# Altium project Lite Carrier for Mu.PrjPcb (part 1 of 2)
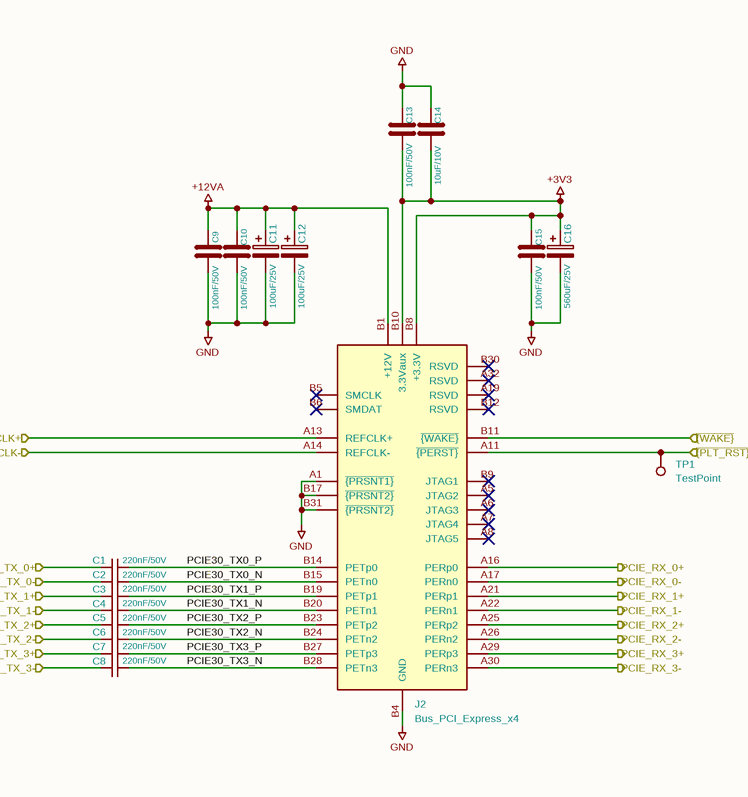
[diagram p0: PCIe x4.SchDoc]
11 sheets, 296 parts. Net scope: flat (ports and power ports of the same name join across sheets).
Board file: Lite Carrier for Mu.PcbDoc
Sheets:
  PCIe x4.SchDoc
  fan_temp.SchDoc
  LattePanda Module.SchDoc
  HDMI.SchDoc
  PSU.SchDoc
  M.2 E&M Key.SchDoc
  Gigabit Ethernet.SchDoc
  GPIO.SchDoc
  USB2.0&USB3.0.SchDoc
  fan&temp.SchDoc
  RTC.SchDoc

## Sheet PCIe x4.SchDoc
size 594 x 420 mm

### Parts
C1  220nF/50V  [C_0402_1005Metric]
C2  220nF/50V  [C_0402_1005Metric]
C3  220nF/50V  [C_0402_1005Metric]
C4  220nF/50V  [C_0402_1005Metric]
C5  220nF/50V  [C_0402_1005Metric]
C6  220nF/50V  [C_0402_1005Metric]
C7  220nF/50V  [C_0402_1005Metric]
C8  220nF/50V  [C_0402_1005Metric]
C9  100nF/50V  [C_0402_1005Metric]
C10  100nF/50V  [C_0402_1005Metric]
C11  100uF/25V  [CP_Elec_6.3x7.7]
C12  100uF/25V  [CP_Elec_6.3x7.7]
C13  100nF/50V  [C_0402_1005Metric]
C14  10uF/10V  [C_0402_1005Metric]
C15  100nF/50V  [C_0402_1005Metric]
C16  560uF/25V  [CP_Elec_6.3x7.7]
J2  Bus_PCI_Express_x4  [PCIe_x4_Gen3Slot_Connectors]
TP1  TestPoint  [TestPoint_Pad_D1.5mm]

### Ports
PCIE_RX_0+ (out), PCIE_RX_0- (out), PCIE_RX_1+ (out), PCIE_RX_1- (out), PCIE_RX_2+ (out), PCIE_RX_2- (out), PCIE_RX_3+ (out), PCIE_RX_3- (out), PCIE_TX_0+ (in), PCIE_TX_0- (in), PCIE_TX_1+ (in), PCIE_TX_1- (in), PCIE_TX_2+ (in), PCIE_TX_2- (in), PCIE_TX_3+ (in), PCIE_TX_3- (in), REFCLK+ (in), REFCLK- (in), ~{{PLT_RST}} (in), ~{{WAKE}} (in)

### Nets
+3V3: C13.2 C14.2 C15.1 C16.1 J2.B8(+3.3V) J2.B10(3.3Vaux)
+12VA: C9.1 C10.1 C11.1 C12.1 J2.B1(+12V)
GND: C9.2 C10.2 C11.2 C12.2 C13.1 C14.1 C15.2 C16.2 J2.A1(~{{PRSNT1}}) J2.B4(GND) J2.B17(~{{PRSNT2}}) J2.B31(~{{PRSNT2}})
PCIE30_TX0_N: C2.2 J2.B15(PETn0)
PCIE30_TX0_P: C1.2 J2.B14(PETp0)
PCIE30_TX1_N: C4.2 J2.B20(PETn1)
PCIE30_TX1_P: C3.2 J2.B19(PETp1)
PCIE30_TX2_N: C6.2 J2.B24(PETn2)
PCIE30_TX2_P: C5.2 J2.B23(PETp2)
PCIE30_TX3_N: C8.2 J2.B28(PETn3)
PCIE30_TX3_P: C7.2 J2.B27(PETp3)
PCIE_RX_0+: J2.A16(PERp0) ; port PCIE_RX_0+
PCIE_RX_0-: J2.A17(PERn0) ; port PCIE_RX_0-
PCIE_RX_1+: J2.A21(PERp1) ; port PCIE_RX_1+
PCIE_RX_1-: J2.A22(PERn1) ; port PCIE_RX_1-
PCIE_RX_2+: J2.A25(PERp2) ; port PCIE_RX_2+
PCIE_RX_2-: J2.A26(PERn2) ; port PCIE_RX_2-
PCIE_RX_3+: J2.A29(PERp3) ; port PCIE_RX_3+
PCIE_RX_3-: J2.A30(PERn3) ; port PCIE_RX_3-
PCIE_TX_0+: C1.1 ; port PCIE_TX_0+
PCIE_TX_0-: C2.1 ; port PCIE_TX_0-
PCIE_TX_1+: C3.1 ; port PCIE_TX_1+
PCIE_TX_1-: C4.1 ; port PCIE_TX_1-
PCIE_TX_2+: C5.1 ; port PCIE_TX_2+
PCIE_TX_2-: C6.1 ; port PCIE_TX_2-
PCIE_TX_3+: C7.1 ; port PCIE_TX_3+
PCIE_TX_3-: C8.1 ; port PCIE_TX_3-
REFCLK+: J2.A13(REFCLK+) ; port REFCLK+
REFCLK-: J2.A14(REFCLK-) ; port REFCLK-
~{{PLT_RST}}: J2.A11(~{{PERST}}) TP1.1 ; port ~{{PLT_RST}}
~{{WAKE}}: J2.B11(~{{WAKE}}) ; port ~{{WAKE}}

Not connected (* = marked no-connect by the designer): J2 A2(+12V) A3(+12V) A4(GND) A5(JTAG2)* A6(JTAG3)* A7(JTAG4)* A8(JTAG5)* A9(+3.3V) A10(+3.3V) A12(GND) A15(GND) A18(GND) A19(RSVD)* A20(GND) A23(GND) A24(GND) A27(GND) A28(GND) A31(GND) A32(RSVD)* B2(+12V) B3(+12V) B5(SMCLK)* B6(SMDAT)* B7(GND) B9(JTAG1)* B12(RSVD)* B13(GND) B16(GND) B18(GND) B21(GND) B22(GND) B25(GND) B26(GND) B29(GND) B30(RSVD)* B32(GND)

### Notes on the sheet
- 1
- 2
- 3
- 4
- 5
- 6
- 7
- 8
- 9
- 10
- 11
- A
- B
- C
- D
- E
- F
- G
- H
- Title: Primer Carrier for LattePanda Mu
- File: PCIe x4.kicad_sch
- Sheet: /
- DFRobot
- KiCad E.D.A.  kicad (5.1.4)-1
- Size: A2
- Date: 2024-03-13
- Rev: V1.0.0
- Id: 1/1

### Library data of the parts
C1-C8 = C_Small: SCH_Show_Footprint: C0402; Value: 220nF/50V; Footprint: A_HDJ_Library:C_0402_1005Metric
C9 C10 C13-C15 = C: SCH_Show_Footprint: C0402; Footprint: A_HDJ_Library:C_0402_1005Metric
  C9 C10 C13 C15: Value: 100nF/50V
  C14: Value: 10uF/10V
C11 C12 C16 = C_Polarized: SCH_Show_Footprint: C5x5.8; Footprint: A_HDJ_Library:CP_Elec_6.3x7.7
  C11 C12: Value: 100uF/25V
  C16: Value: 560uF/25V
J2 = Bus_PCI_Express_x4: Value: Bus_PCI_Express_x4; Footprint: A_HDJ_Library:PCIe_x4_Gen3Slot_Connectors
TP1 = TestPoint: Value: TestPoint; Footprint: A_HDJ_Library:TestPoint_Pad_D1.5mm

## Sheet fan_temp.SchDoc
size 594 x 420 mm
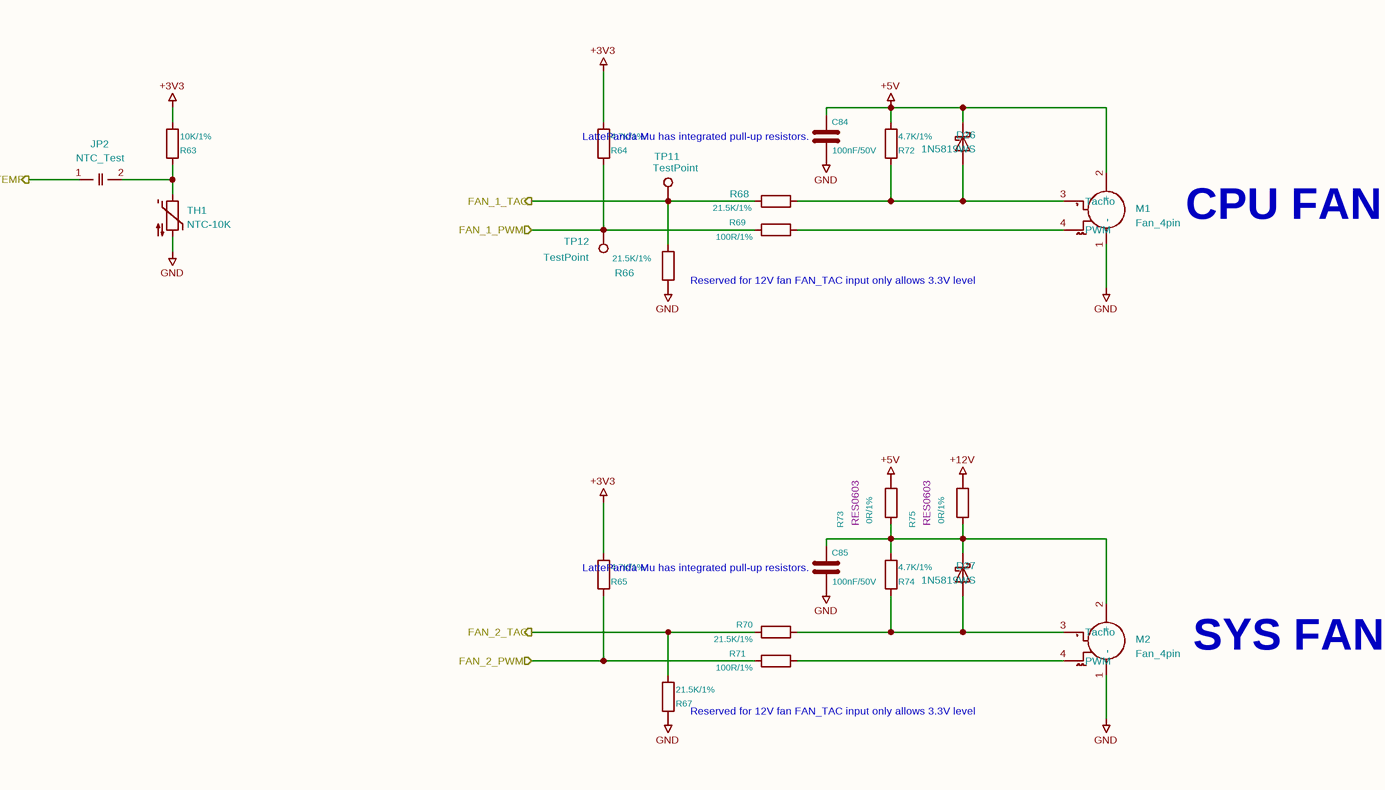
[diagram p1: fan_temp.SchDoc]

### Parts
(Parts that share a designator on the sheet are numbered #1, #2 ... from top to bottom, then left to right.)
C84  100nF/50V  [C_0402_1005Metric]
C85  100nF/50V  [C_0402_1005Metric]
D26  1N5819WS  [D_SOD-323]
D27  1N5819WS  [D_SOD-323]
JP2#1  NTC_Test  [SolderJumper-2_P1.3mm_Open_RoundedPad1.0x1.5mm]
M1#1  Fan_4pin  [JST_PH_B4B-PH-K_1x04_P2.00mm_Vertical]
M2#1  Fan_4pin  [JST_PH_B4B-PH-K_1x04_P2.00mm_Vertical]
R63  10K/1%  [R_0402_1005Metric]
R64  4.7K/1%  [R_0402_1005Metric]
R65  4.7K/1%  [R_0402_1005Metric]
R66  21.5K/1%  [R_0402_1005Metric]
R67  21.5K/1%  [R_0402_1005Metric]
R68  21.5K/1%  [R_0402_1005Metric]
R69  100R/1%  [R_0402_1005Metric]
R70  21.5K/1%  [R_0402_1005Metric]
R71  100R/1%  [R_0402_1005Metric]
R72  4.7K/1%  [R_0402_1005Metric]
R73  0R/1%  [RES0603]
R74  4.7K/1%  [R_0402_1005Metric]
R75  0R/1%  [RES0603]
TH1#1  NTC-10K  [R_0603_1608Metric]
TP11  TestPoint  [TestPoint_Pad_D1.5mm]
TP12  TestPoint  [TestPoint_Pad_D1.5mm]

### Ports
FAN_1_PWM (in), FAN_1_TAC (out), FAN_2_PWM (in), FAN_2_TAC (out), TEMP (out)

### Nets
+3V3: R63.1 R64.1 R65.1
+5V: C84.1 D26.1(K) M1#1.2(+) R72.1 R73.2
+12V: R75.2
GND: C84.2 C85.2 M1#1.1(-) M2#1.1(-) R66.2 R67.2 TH1#1.2
FAN_1_PWM: R64.2 R69.1 TP12.1 ; port FAN_1_PWM
FAN_1_TAC: R66.1 R68.2 TP11.1 ; port FAN_1_TAC
FAN_2_PWM: R65.2 R71.1 ; port FAN_2_PWM
FAN_2_TAC: R67.1 R70.1 ; port FAN_2_TAC
TEMP: JP2#1.1(A) ; port TEMP
NetC85_1: C85.1 D27.1(K) M2#1.2(+) R73.1 R74.1 R75.1
NetD26_2: D26.2(A) M1#1.3(Tacho) R68.1 R72.2
NetD27_2: D27.2(A) M2#1.3(Tacho) R70.2 R74.2
NetJP2#1_2: JP2#1.2(B) R63.2 TH1#1.1
NetM1#1_4: M1#1.4(PWM) R69.2
NetM2#1_4: M2#1.4(PWM) R71.2

### Notes on the sheet
- LattePanda Mu has integrated pull-up resistors.
- CPU FAN
- (near R66) Reserved for 12V fan
  FAN_TAC input only allows 3.3V level
- SYS FAN
- (near R67) Reserved for 12V fan
  FAN_TAC input only allows 3.3V level
- 1
- 2
- 3
- 4
- 5
- 6
- 7
- 8
- 9
- 10
- 11
- A
- B
- C
- D
- E
- F
- G
- H
- Title: Primer Carrier for LattePanda Mu
- File: fan_temp.kicad_sch
- Sheet: /
- DFRobot
- KiCad E.D.A.  kicad (5.1.4)-1
- Size: A2
- Date: 2024-03-13
- Rev: V1.0.0
- Id: 1/1

### Library data of the parts
C84 C85 = C: SCH_Show_Footprint: C0402; Value: 100nF/50V
  C84: Footprint: A_HDJ_Library:C_0402_1005Metric
  C85: Footprint: Capacitor_SMD:C_0402_1005Metric
D26 D27 = 1N5819WS: SCH_Show_Footprint: SOD-323; Value: 1N5819WS
  D26: Footprint: A_HDJ_Library:D_SOD-323
  D27: Footprint: Diode_SMD:D_SOD-323
JP2#1 = SolderJumper_2_Open: Value: NTC_Test; Footprint: Jumper:SolderJumper-2_P1.3mm_Open_RoundedPad1.0x1.5mm
R63-R75 = R
  R63: Value: 10K/1%; Footprint: Resistor_SMD:R_0402_1005Metric
  R64 R65 R74: Value: 4.7K/1%; Footprint: Resistor_SMD:R_0402_1005Metric
  R66 R67 R70: Value: 21.5K/1%; Footprint: Resistor_SMD:R_0402_1005Metric
  R68: Value: 21.5K/1%; Footprint: A_HDJ_Library:R_0402_1005Metric
  R69: Value: 100R/1%; Footprint: A_HDJ_Library:R_0402_1005Metric
  R71: Value: 100R/1%; Footprint: Resistor_SMD:R_0402_1005Metric
  R72: Value: 4.7K/1%; Footprint: A_HDJ_Library:R_0402_1005Metric
  R73 R75: Value: 0R/1%
TH1#1 = Thermistor_NTC: Value: NTC-10K; Footprint: Resistor_SMD:R_0603_1608Metric
M1#1 M2#1 = Fan_4pin: Value: Fan_4pin
  M1#1: Footprint: A_HDJ_Library:JST_PH_B4B-PH-K_1x04_P2.00mm_Vertical
  M2#1: Footprint: Connector_JST:JST_PH_B4B-PH-K_1x04_P2.00mm_Vertical
TP11 TP12 = TestPoint: Value: TestPoint; Footprint: A_HDJ_Library:TestPoint_Pad_D1.5mm

## Sheet LattePanda Module.SchDoc
size 594 x 420 mm
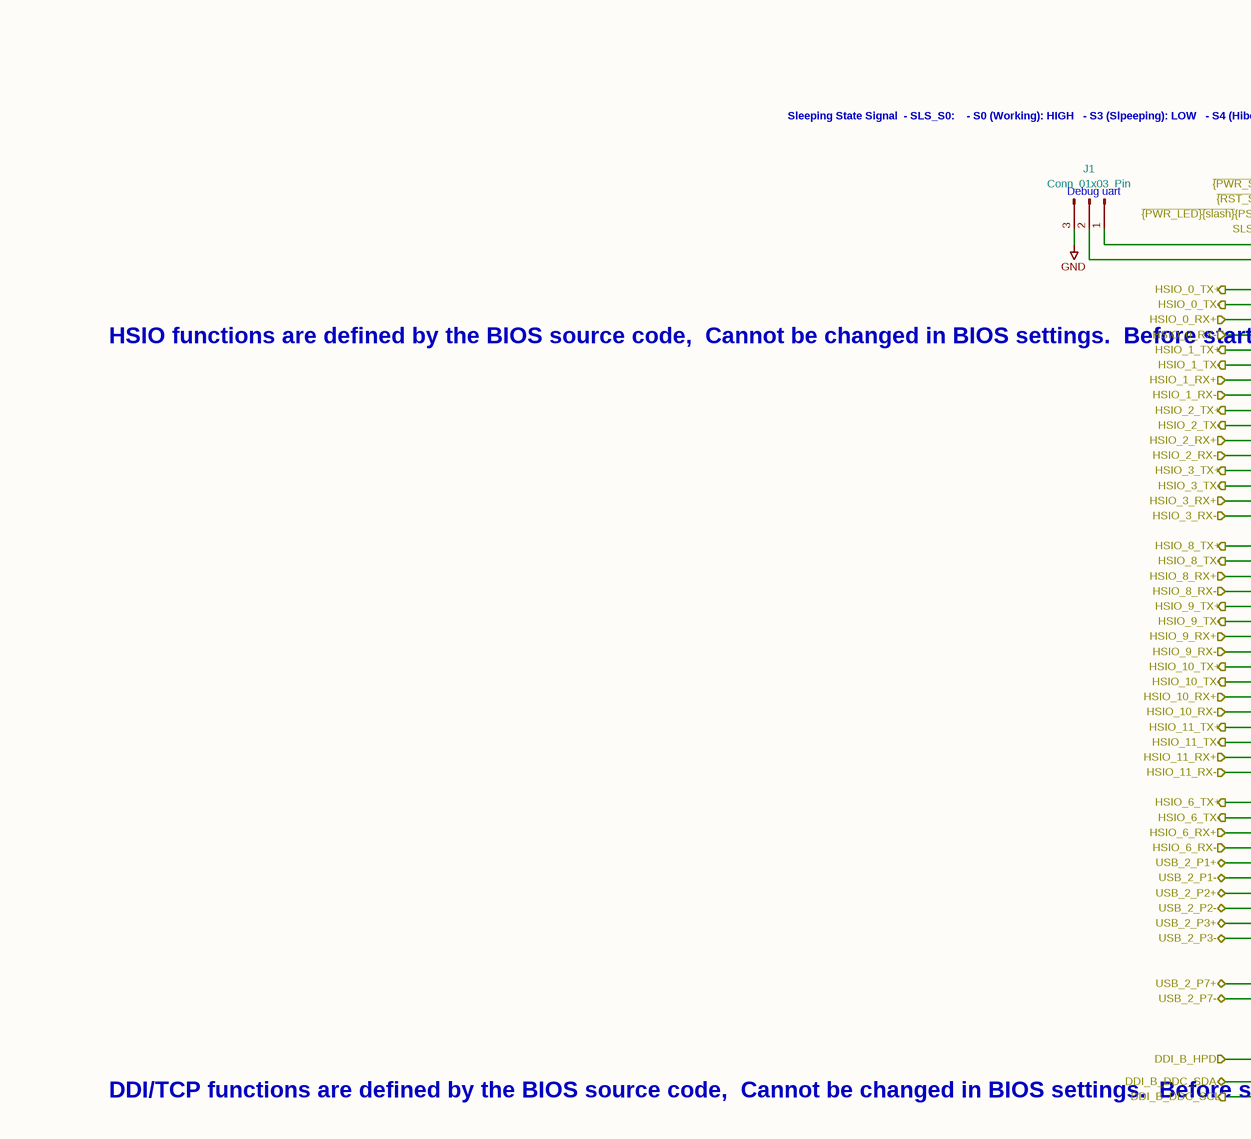
[diagram p2: LattePanda Module.SchDoc, top left]
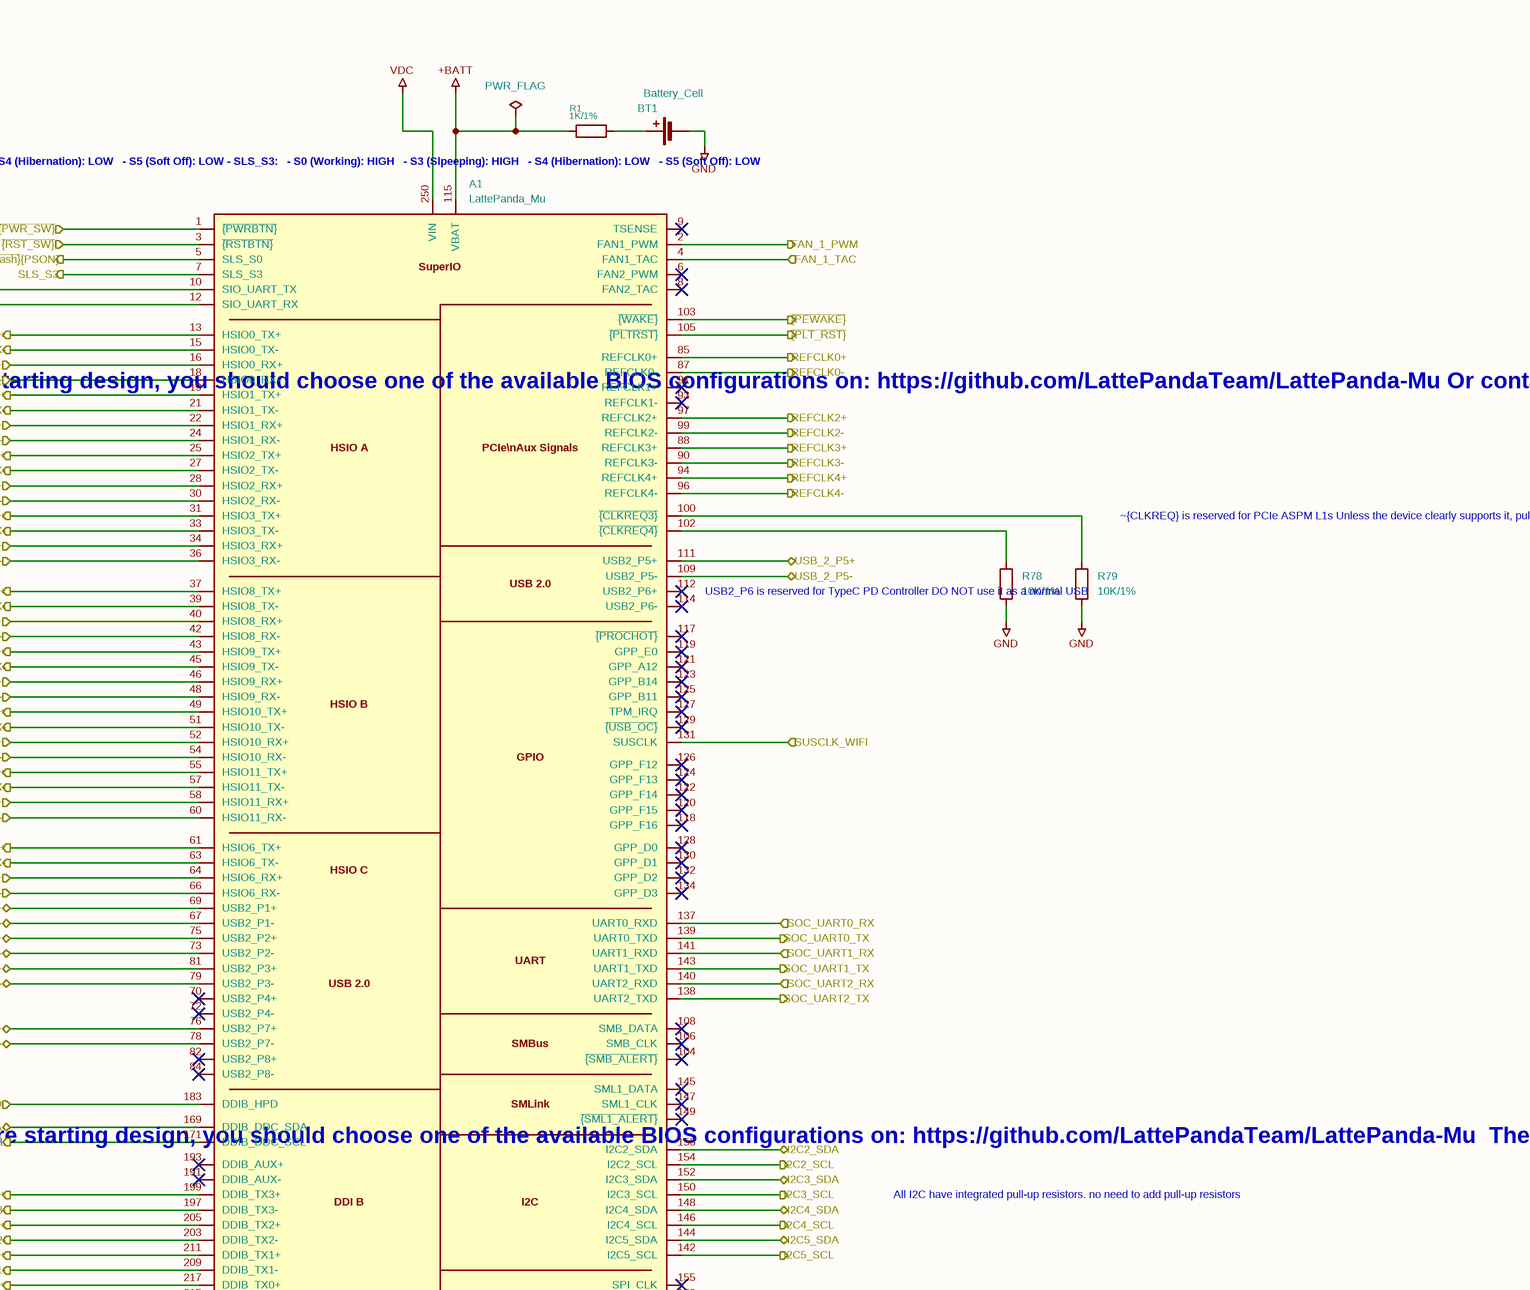
[diagram p3: LattePanda Module.SchDoc, top right]
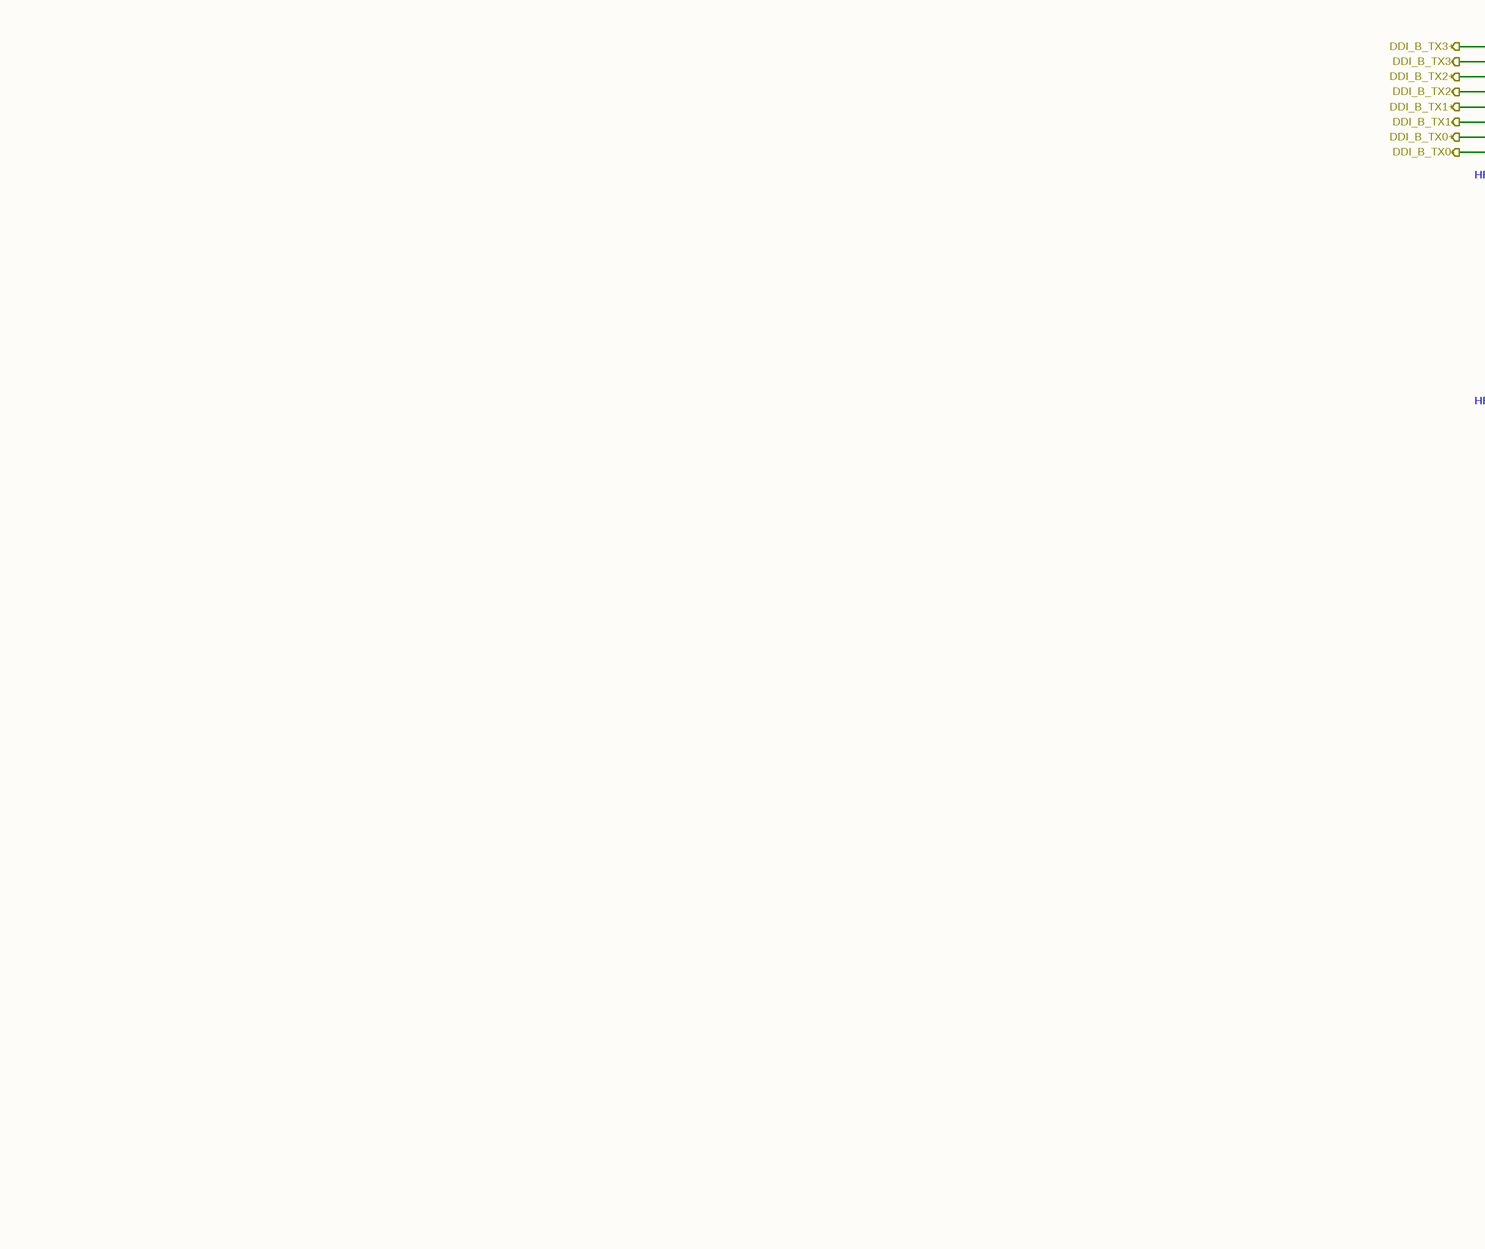
[diagram p4: LattePanda Module.SchDoc, bottom left]
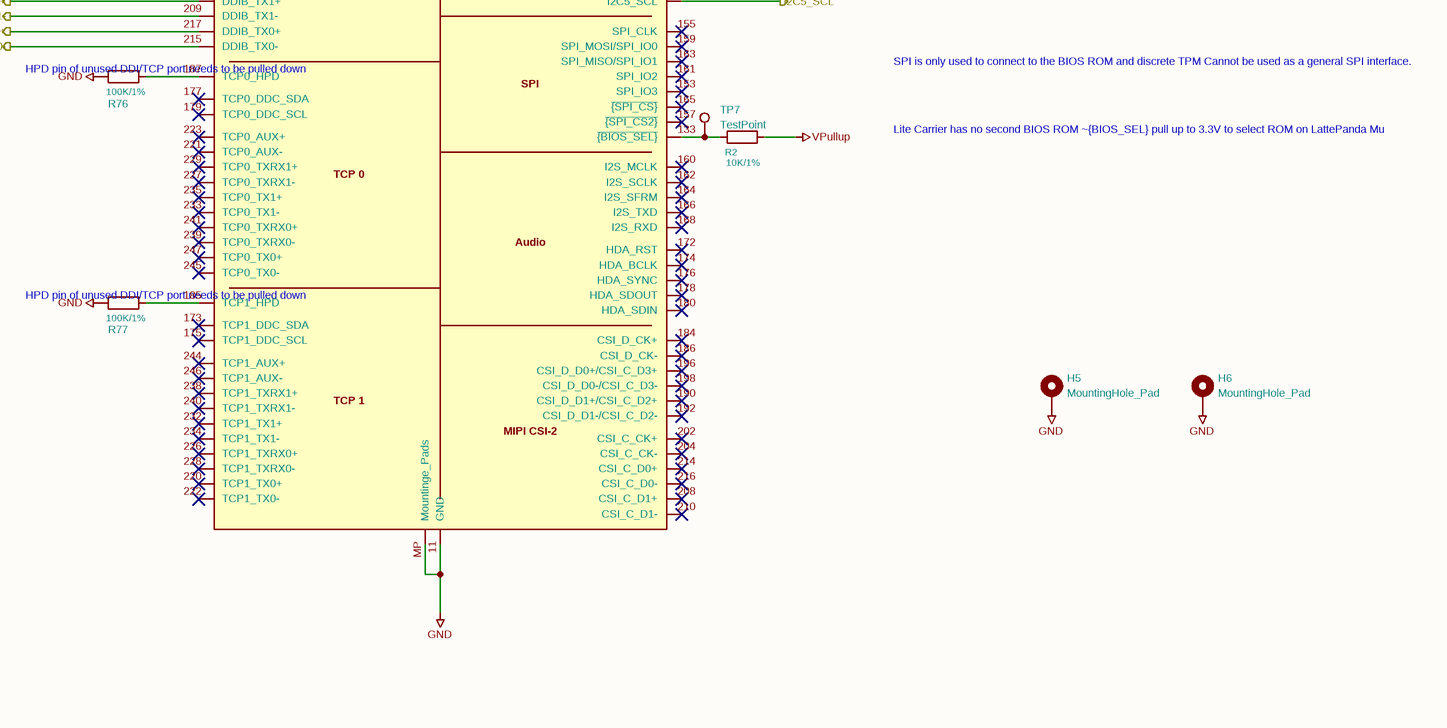
[diagram p5: LattePanda Module.SchDoc, bottom right]

### Parts
(Parts that share a designator on the sheet are numbered #1, #2 ... from top to bottom, then left to right.)
#FLG0201  PWR_FLAG  (graphical)
A1  LattePanda_Mu  [LattePanda_Module_H8.0mm_Horizontal]
BT1  Battery_Cell  [Battery_Holder_CR1220_S8411-45R]
H5  MountingHole_Pad  [MountingHole_3mm_M2_Pad_TopOnly]
H6  MountingHole_Pad  [MountingHole_3mm_M2_Pad_TopOnly]
J1  Conn_01x03_Pin  [PinHeader_1x03_P2.54mm_Vertical]
R1#1  1K/1%  [R_0402_1005Metric]
R2  10K/1%  [R_0402_1005Metric]
R76  100K/1%  [R_0402_1005Metric]
R77  100K/1%  [R_0402_1005Metric]
R78  10K/1%  [R_0402_1005Metric]
R79  10K/1%  [R_0402_1005Metric]
TP7  TestPoint  [TestPoint_Pad_D1.5mm]

### Ports
DDI_B_DDC_SCL (out), DDI_B_DDC_SDA (bidir), DDI_B_HPD (in), DDI_B_TX0+ (out), DDI_B_TX0- (out), DDI_B_TX1+ (out), DDI_B_TX1- (out), DDI_B_TX2+ (out), DDI_B_TX2- (out), DDI_B_TX3+ (out), DDI_B_TX3- (out), FAN_1_PWM (out), FAN_1_TAC (in), HSIO_0_RX+ (in), HSIO_0_RX- (in), HSIO_0_TX+ (out), HSIO_0_TX- (out), HSIO_1_RX+ (in), HSIO_1_RX- (in), HSIO_1_TX+ (out), HSIO_1_TX- (out), HSIO_2_RX+ (in), HSIO_2_RX- (in), HSIO_2_TX+ (out), HSIO_2_TX- (out), HSIO_3_RX+ (in), HSIO_3_RX- (in), HSIO_3_TX+ (out), HSIO_3_TX- (out), HSIO_6_RX+ (in), HSIO_6_RX- (in), HSIO_6_TX+ (out), HSIO_6_TX- (out), HSIO_8_RX+ (in), HSIO_8_RX- (in), HSIO_8_TX+ (out), HSIO_8_TX- (out), HSIO_9_RX+ (in), HSIO_9_RX- (in), HSIO_9_TX+ (out), HSIO_9_TX- (out), HSIO_10_RX+ (in), HSIO_10_RX- (in), HSIO_10_TX+ (out), HSIO_10_TX- (out), HSIO_11_RX+ (in), HSIO_11_RX- (in), HSIO_11_TX+ (out), HSIO_11_TX- (out), I2C2_SCL (out), I2C2_SDA (bidir), I2C3_SCL (out), I2C3_SDA (bidir), I2C4_SCL (out), I2C4_SDA (bidir), I2C5_SCL (out), I2C5_SDA (bidir), REFCLK0+ (out), REFCLK0- (out), REFCLK2+ (out), REFCLK2- (out), REFCLK3+ (out), REFCLK3- (out), REFCLK4+ (out), REFCLK4- (out), SLS_S3 (out), SOC_UART0_RX (in), SOC_UART0_TX (out), SOC_UART1_RX (in), SOC_UART1_TX (out), SOC_UART2_RX (in), SOC_UART2_TX (out), SUSCLK_WIFI (in), USB_2_P1+ (bidir), USB_2_P1- (bidir), USB_2_P2+ (bidir), USB_2_P2- (bidir), USB_2_P3+ (bidir), USB_2_P3- (bidir), USB_2_P5+ (bidir), USB_2_P5- (bidir), USB_2_P7+ (bidir), USB_2_P7- (bidir), ~{{PEWAKE}} (out), ~{{PLT_RST}} (out), ~{{PWR_LED}{slash}}{PSON} (out), ~{{PWR_SW}} (in), ~{{RST_SW}} (in)

### Nets
+BATT: #FLG0201.1 A1.115(VBAT) R1#1.1
GND: A1.11(GND) A1.MP(Mountinge_Pads) BT1.2(-) H5.1 H6.1 J1.3(Pin_3) R76.2 R77.2 R78.2 R79.2
VDC: A1.250(VIN)
VPullup: R2.2
CON_USB1_D_N: A1.109(USB2_P5-) ; port USB_2_P5-
CON_USB1_D_P: A1.111(USB2_P5+) ; port USB_2_P5+
CON_USB2_D_N: A1.79(USB2_P3-) ; port USB_2_P3-
CON_USB2_D_P: A1.81(USB2_P3+) ; port USB_2_P3+
CON_USB3_D_N: A1.73(USB2_P2-) ; port USB_2_P2-
CON_USB3_D_P: A1.75(USB2_P2+) ; port USB_2_P2+
CON_USB4_D_N: A1.67(USB2_P1-) ; port USB_2_P1-
CON_USB4_D_P: A1.69(USB2_P1+) ; port USB_2_P1+
DDI_B_DDC_SCL: A1.171(DDIB_DDC_SCL) ; port DDI_B_DDC_SCL
DDI_B_DDC_SDA: A1.169(DDIB_DDC_SDA) ; port DDI_B_DDC_SDA
DDI_B_HPD: A1.183(DDIB_HPD) ; port DDI_B_HPD
DDI_B_TX0+: A1.217(DDIB_TX0+) ; port DDI_B_TX0+
DDI_B_TX0-: A1.215(DDIB_TX0-) ; port DDI_B_TX0-
DDI_B_TX1+: A1.211(DDIB_TX1+) ; port DDI_B_TX1+
DDI_B_TX1-: A1.209(DDIB_TX1-) ; port DDI_B_TX1-
DDI_B_TX2+: A1.205(DDIB_TX2+) ; port DDI_B_TX2+
DDI_B_TX2-: A1.203(DDIB_TX2-) ; port DDI_B_TX2-
DDI_B_TX3+: A1.199(DDIB_TX3+) ; port DDI_B_TX3+
DDI_B_TX3-: A1.197(DDIB_TX3-) ; port DDI_B_TX3-
FAN_1_PWM: A1.2(FAN1_PWM) ; port FAN_1_PWM
FAN_1_TAC: A1.4(FAN1_TAC) ; port FAN_1_TAC
HSIO_0_RX+: A1.16(HSIO0_RX+) ; port HSIO_0_RX+
HSIO_0_RX-: A1.18(HSIO0_RX-) ; port HSIO_0_RX-
HSIO_0_TX+: A1.13(HSIO0_TX+) ; port HSIO_0_TX+
HSIO_0_TX-: A1.15(HSIO0_TX-) ; port HSIO_0_TX-
HSIO_1_RX+: A1.22(HSIO1_RX+) ; port HSIO_1_RX+
HSIO_1_RX-: A1.24(HSIO1_RX-) ; port HSIO_1_RX-
HSIO_1_TX+: A1.19(HSIO1_TX+) ; port HSIO_1_TX+
HSIO_1_TX-: A1.21(HSIO1_TX-) ; port HSIO_1_TX-
HSIO_2_RX+: A1.28(HSIO2_RX+) ; port HSIO_2_RX+
HSIO_2_RX-: A1.30(HSIO2_RX-) ; port HSIO_2_RX-
HSIO_2_TX+: A1.25(HSIO2_TX+) ; port HSIO_2_TX+
HSIO_2_TX-: A1.27(HSIO2_TX-) ; port HSIO_2_TX-
HSIO_3_RX+: A1.34(HSIO3_RX+) ; port HSIO_3_RX+
HSIO_3_RX-: A1.36(HSIO3_RX-) ; port HSIO_3_RX-
HSIO_3_TX+: A1.31(HSIO3_TX+) ; port HSIO_3_TX+
HSIO_3_TX-: A1.33(HSIO3_TX-) ; port HSIO_3_TX-
HSIO_6_RX+: A1.64(HSIO6_RX+) ; port HSIO_6_RX+
HSIO_6_RX-: A1.66(HSIO6_RX-) ; port HSIO_6_RX-
HSIO_6_TX+: A1.61(HSIO6_TX+) ; port HSIO_6_TX+
HSIO_6_TX-: A1.63(HSIO6_TX-) ; port HSIO_6_TX-
HSIO_8_RX+: A1.40(HSIO8_RX+) ; port HSIO_8_RX+
HSIO_8_RX-: A1.42(HSIO8_RX-) ; port HSIO_8_RX-
HSIO_8_TX+: A1.37(HSIO8_TX+) ; port HSIO_8_TX+
HSIO_8_TX-: A1.39(HSIO8_TX-) ; port HSIO_8_TX-
HSIO_9_RX+: A1.46(HSIO9_RX+) ; port HSIO_9_RX+
HSIO_9_RX-: A1.48(HSIO9_RX-) ; port HSIO_9_RX-
HSIO_9_TX+: A1.43(HSIO9_TX+) ; port HSIO_9_TX+
HSIO_9_TX-: A1.45(HSIO9_TX-) ; port HSIO_9_TX-
HSIO_10_RX+: A1.52(HSIO10_RX+) ; port HSIO_10_RX+
HSIO_10_RX-: A1.54(HSIO10_RX-) ; port HSIO_10_RX-
HSIO_10_TX+: A1.49(HSIO10_TX+) ; port HSIO_10_TX+
HSIO_10_TX-: A1.51(HSIO10_TX-) ; port HSIO_10_TX-
HSIO_11_RX+: A1.58(HSIO11_RX+) ; port HSIO_11_RX+
HSIO_11_RX-: A1.60(HSIO11_RX-) ; port HSIO_11_RX-
HSIO_11_TX+: A1.55(HSIO11_TX+) ; port HSIO_11_TX+
HSIO_11_TX-: A1.57(HSIO11_TX-) ; port HSIO_11_TX-
I2C2_SCL: A1.154(I2C2_SCL) ; port I2C2_SCL
I2C2_SDA: A1.156(I2C2_SDA) ; port I2C2_SDA
I2C3_SCL: A1.150(I2C3_SCL) ; port I2C3_SCL
I2C3_SDA: A1.152(I2C3_SDA) ; port I2C3_SDA
I2C4_SCL: A1.146(I2C4_SCL) ; port I2C4_SCL
I2C4_SDA: A1.148(I2C4_SDA) ; port I2C4_SDA
I2C5_SCL: A1.142(I2C5_SCL) ; port I2C5_SCL
I2C5_SDA: A1.144(I2C5_SDA) ; port I2C5_SDA
REFCLK0+: A1.85(REFCLK0+) ; port REFCLK0+
REFCLK0-: A1.87(REFCLK0-) ; port REFCLK0-
REFCLK2+: A1.97(REFCLK2+) ; port REFCLK2+
REFCLK2-: A1.99(REFCLK2-) ; port REFCLK2-
REFCLK3+: A1.88(REFCLK3+) ; port REFCLK3+
REFCLK3-: A1.90(REFCLK3-) ; port REFCLK3-
REFCLK4+: A1.94(REFCLK4+) ; port REFCLK4+
REFCLK4-: A1.96(REFCLK4-) ; port REFCLK4-
SLS_S3: A1.7(SLS_S3) ; port SLS_S3
SOC_UART0_RX: A1.137(UART0_RXD) ; port SOC_UART0_RX
SOC_UART0_TX: A1.139(UART0_TXD) ; port SOC_UART0_TX
SOC_UART1_RX: A1.141(UART1_RXD) ; port SOC_UART1_RX
SOC_UART1_TX: A1.143(UART1_TXD) ; port SOC_UART1_TX
SOC_UART2_RX: A1.140(UART2_RXD) ; port SOC_UART2_RX
SOC_UART2_TX: A1.138(UART2_TXD) ; port SOC_UART2_TX
SUSCLK_WIFI: A1.131(SUSCLK) ; port SUSCLK_WIFI
USB_2_P7+: A1.76(USB2_P7+) ; port USB_2_P7+
USB_2_P7-: A1.78(USB2_P7-) ; port USB_2_P7-
~{{PEWAKE}}: A1.103(~{{WAKE}}) ; port ~{{PEWAKE}}
~{{PLT_RST}}: A1.105(~{{PLTRST}}) ; port ~{{PLT_RST}}
~{{PWR_LED}{slash}}{PSON}: A1.5(SLS_S0) ; port ~{{PWR_LED}{slash}}{PSON}
~{{PWR_SW}}: A1.1(~{{PWRBTN}}) ; port ~{{PWR_SW}}
~{{RST_SW}}: A1.3(~{{RSTBTN}}) ; port ~{{RST_SW}}
NetA1_10: A1.10(SIO_UART_TX) J1.1(Pin_1)
NetA1_12: A1.12(SIO_UART_RX) J1.2(Pin_2)
NetA1_100: A1.100(~{{CLKREQ3}}) R79.1
NetA1_102: A1.102(~{{CLKREQ4}}) R78.1
NetA1_133: A1.133(~{{BIOS_SEL}}) R2.1 TP7.1
NetA1_185: A1.185(TCP1_HPD) R77.1
NetA1_187: A1.187(TCP0_HPD) R76.1
NetBT1_1: BT1.1(+) R1#1.2

Not connected (* = marked no-connect by the designer): A1 6(FAN2_PWM)* 8(FAN2_TAC)* 9(TSENSE)* 14(GND) 17(GND) 20(GND) 23(GND) 26(GND) 29(GND) 32(GND) 35(GND) 38(GND) 41(GND) 44(GND) 47(GND) 50(GND) 53(GND) 56(GND) 59(GND) 62(GND) 65(GND) 68(GND) 70(USB2_P4+)* 71(GND) 72(USB2_P4-)* 74(GND) 77(GND) 80(GND) 82(USB2_P8+)* 83(GND) 84(USB2_P8-)* 86(GND) 89(GND) 91(REFCLK1+)* 92(GND) 93(REFCLK1-)* 95(GND) 98(GND) 101(GND) 104(~{{SMB_ALERT}})* 106(SMB_CLK)* 107(GND) 108(SMB_DATA)* 110(GND) 112(USB2_P6+)* 113(GND) 114(USB2_P6-)* 116(GND) 117(~{{PROCHOT}})* 118(GPP_F16)* 119(GPP_E0)* 120(GPP_F15)* 121(GPP_A12)* 122(GPP_F14)* 123(GPP_B14)* 124(GPP_F13)* 125(GPP_B11)* 126(GPP_F12)* 127(TPM_IRQ)* 128(GPP_D0)* 129(~{{USB_OC}})* 130(GPP_D1)* 132(GPP_D2)* 134(GPP_D3)* 135(GND) 136(GND) 145(SML1_DATA)* 147(SML1_CLK)* 149(~{{SML1_ALERT}})* 151(GND) 153(SPI_IO3)* 155(SPI_CLK)* 157(~{{SPI_CS2}})* 158(GND) 159(SPI_MOSI/SPI_IO0)* 160(I2S_MCLK)* 161(SPI_IO2)* 162(I2S_SCLK)* 163(SPI_MISO/SPI_IO1)* 164(I2S_SFRM)* 165(~{{SPI_CS}})* 166(I2S_TXD)* 167(GND) 168(I2S_RXD)* 170(GND) 172(HDA_RST)* 173(TCP1_DDC_SDA)* 174(HDA_BCLK)* 175(TCP1_DDC_SCL)* 176(HDA_SYNC)* 177(TCP0_DDC_SDA)* 178(HDA_SDOUT)* 179(TCP0_DDC_SCL)* 180(HDA_SDIN)* 181(GND) 182(GND) 184(CSI_D_CK+)* 186(CSI_D_CK-)* 188(GND) 189(GND) 190(CSI_D_D1+/CSI_C_D2+)* 191(DDIB_AUX-)* 192(CSI_D_D1-/CSI_C_D2-)* 193(DDIB_AUX+)* 194(GND) 195(GND) 196(CSI_D_D0+/CSI_C_D3+)* 198(CSI_D_D0-/CSI_C_D3-)* 200(GND) 201(GND) 202(CSI_C_CK+)* 204(CSI_C_CK-)* 206(GND) 207(GND) 208(CSI_C_D1+)* 210(CSI_C_D1-)* 212(GND) 213(GND) 214(CSI_C_D0+)* 216(CSI_C_D0-)* 218(GND) 219(GND) 220(TCP1_TX0+)* 221(TCP0_AUX-)* 222(TCP1_TX0-)* 223(TCP0_AUX+)* 224(GND) 225(GND) 226(TCP1_TXRX0+)* 227(TCP0_TXRX1-)* 228(TCP1_TXRX0-)* 229(TCP0_TXRX1+)* 230(GND) 231(GND) 232(TCP1_TX1+)* 233(TCP0_TX1-)* 234(TCP1_TX1-)* 235(TCP0_TX1+)* 236(GND) 237(GND) 238(TCP1_TXRX1+)* 239(TCP0_TXRX0-)* 240(TCP1_TXRX1-)* 241(TCP0_TXRX0+)* 242(GND) 243(GND) 244(TCP1_AUX+)* 245(TCP0_TX0-)* 246(TCP1_AUX-)* 247(TCP0_TX0+)* 248(GND) 249(GND) 251(VIN) 252(VIN) 253(VIN) 254(VIN) 255(VIN) 256(VIN) 257(VIN) 258(VIN) 259(VIN) 260(VIN)

### Notes on the sheet
- Sleeping State Signal
  - SLS_S0:
  - S0 (Working): HIGH
  - S3 (Slpeeping): LOW
  - S4 (Hibernation): LOW
  - S5 (Soft Off): LOW
  - SLS_S3:
  - S0 (Working): HIGH
  - S3 (Slpeeping): HIGH
  - S4 (Hibernation): LOW
  - S5 (Soft Off): LOW
- (near J1) Debug uart
- (near A1) HSIO functions are defined by the BIOS source code,
  Cannot be changed in BIOS settings.
  Before starting design, you should choose one of
  the available BIOS configurations on:
  https://github.com/LattePandaTeam/LattePanda-Mu
  Or contact techsupport for custom your BIOS
  The default functions are defined as follows:
  - HSIO0: USB3.2 10Gbps
  - HSIO1: USB3.2 10Gbps
  - HSIO2: PCIe 3.0 x1
  - HSIO3: PCIe 3.0 x1
  - HSIO8: PCIe 3.0 x4 (Lane 0)
  - HSIO9: PCIe 3.0 x4 (Lane 1)
  - HSIO10: PCIe 3.0 x4 (Lane 2)
  - HSIO11: PCIe 3.0 x4 (Lane 3)
  - HSIO6: PCIe 3.0 x1
- (near R79) ~{CLKREQ} is reserved for PCIe ASPM L1s
  Unless the device clearly supports it, pull it down to enhance compatibility
- USB2_P6 is reserved for TypeC PD Controller
  DO NOT use it as a normal USB
- (near A1) DDI/TCP functions are defined by the BIOS source code,
  Cannot be changed in BIOS settings.
  Before starting design, you should choose one of
  the available BIOS configurations on:
  https://github.com/LattePandaTeam/LattePanda-Mu
  The default functions are defined as follows:
  - DDIA: eDP 1.4b (the 40Pin connector on the Mu)
  - DDIB: HDMI 2.0
  - TCP0: HDMI 2.0
  - TCP1: USB TypeC (need external PD controller)
- All I2C have integrated pull-up resistors.
  no need to add pull-up resistors
- HPD pin of unused DDI/TCP port
  needs to be pulled down
- SPI is only used to connect to the BIOS ROM and discrete TPM
  Cannot be used as a general SPI interface.
- Lite Carrier has no second BIOS ROM
  ~{BIOS_SEL} pull up to 3.3V to select ROM on LattePanda Mu
- 1
- 2
- 3
- 4
- 5
- 6
- 7
- 8
- 9
- 10
- 11
- A
- B
- C
- D
- E
- F
- G
- H
- 20240406
- Title: Primer Carrier for LattePanda Mu
- File: LattePanda Module.kicad_sch
- Sheet: /
- DFRobot
- KiCad E.D.A.  kicad (5.1.4)-1
- Size: A2
- Date: 2024-04-06
- Rev: V1.0.0
- Id: 1/1
- (in symbol LattePanda_Mu) SuperIO; HSIO A; PCIe\nAux Signals; USB 2.0; HSIO B; GPIO; HSIO C; UART; SMBus; SMLink; DDI B; I2C; SPI; TCP 0; Audio; TCP 1; MIPI CSI-2

### Library data of the parts
R1#1 R2 R76-R79 = R
  R1#1: Value: 1K/1%; Footprint: A_HDJ_Library:R_0402_1005Metric
  R2: Value: 10K/1%; Footprint: A_HDJ_Library:R_0402_1005Metric
  R76 R77: Value: 100K/1%; Footprint: A_HDJ_Library:R_0402_1005Metric
  R78 R79: Value: 10K/1%; Footprint: Resistor_SMD:R_0402_1005Metric
#FLG0201 = PWR_FLAG: Value: PWR_FLAG
A1 = LattePanda_Mu: Value: LattePanda_Mu; Footprint: Module_LattePanda:LattePanda_Module_H8.0mm_Horizontal
BT1 = Battery_Cell: Value: Battery_Cell; Footprint: A_HDJ_Library:Battery_Holder_CR1220_S8411-45R
H5 H6 = MountingHole_Pad: Value: MountingHole_Pad; Footprint: A_HDJ_Library:MountingHole_3mm_M2_Pad_TopOnly
J1 = Conn_01x03_Pin: Value: Conn_01x03_Pin; Footprint: A_HDJ_Library:PinHeader_1x03_P2.54mm_Vertical
TP7 = TestPoint: Value: TestPoint; Footprint: A_HDJ_Library:TestPoint_Pad_D1.5mm

## Sheet HDMI.SchDoc
size 594 x 420 mm
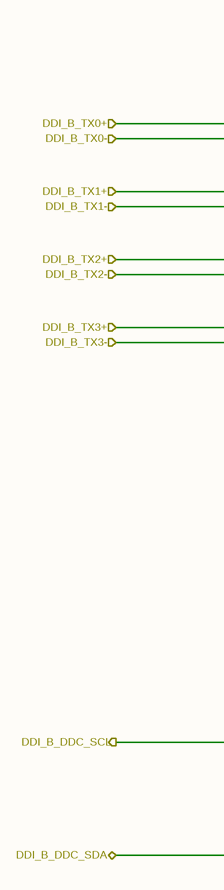
[diagram p6: HDMI.SchDoc, top left]
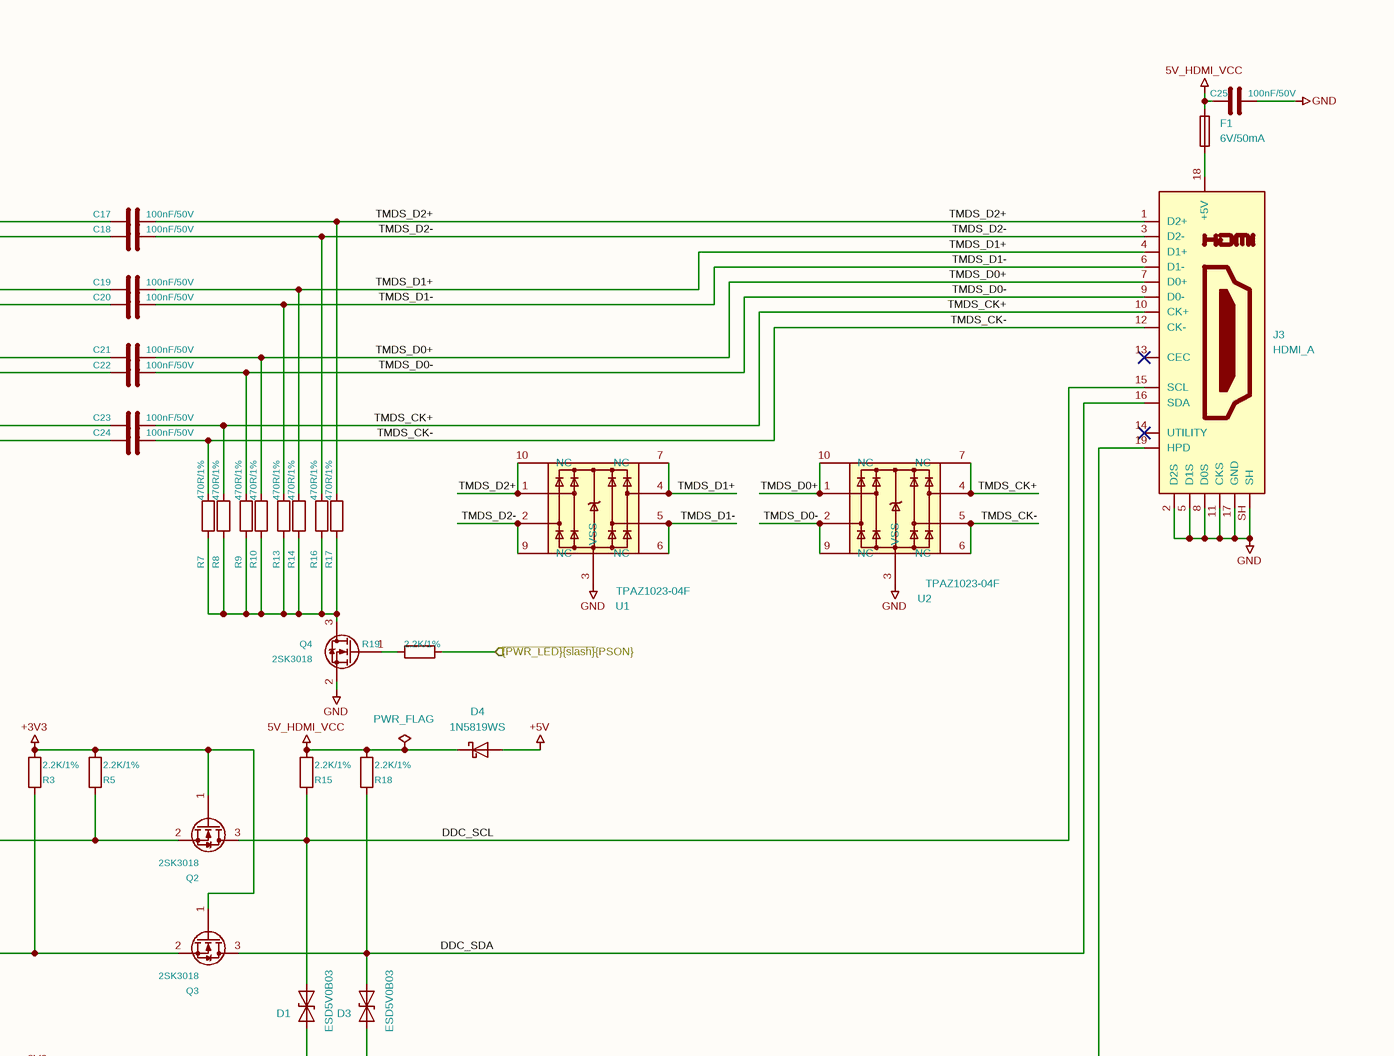
[diagram p7: HDMI.SchDoc, top right]
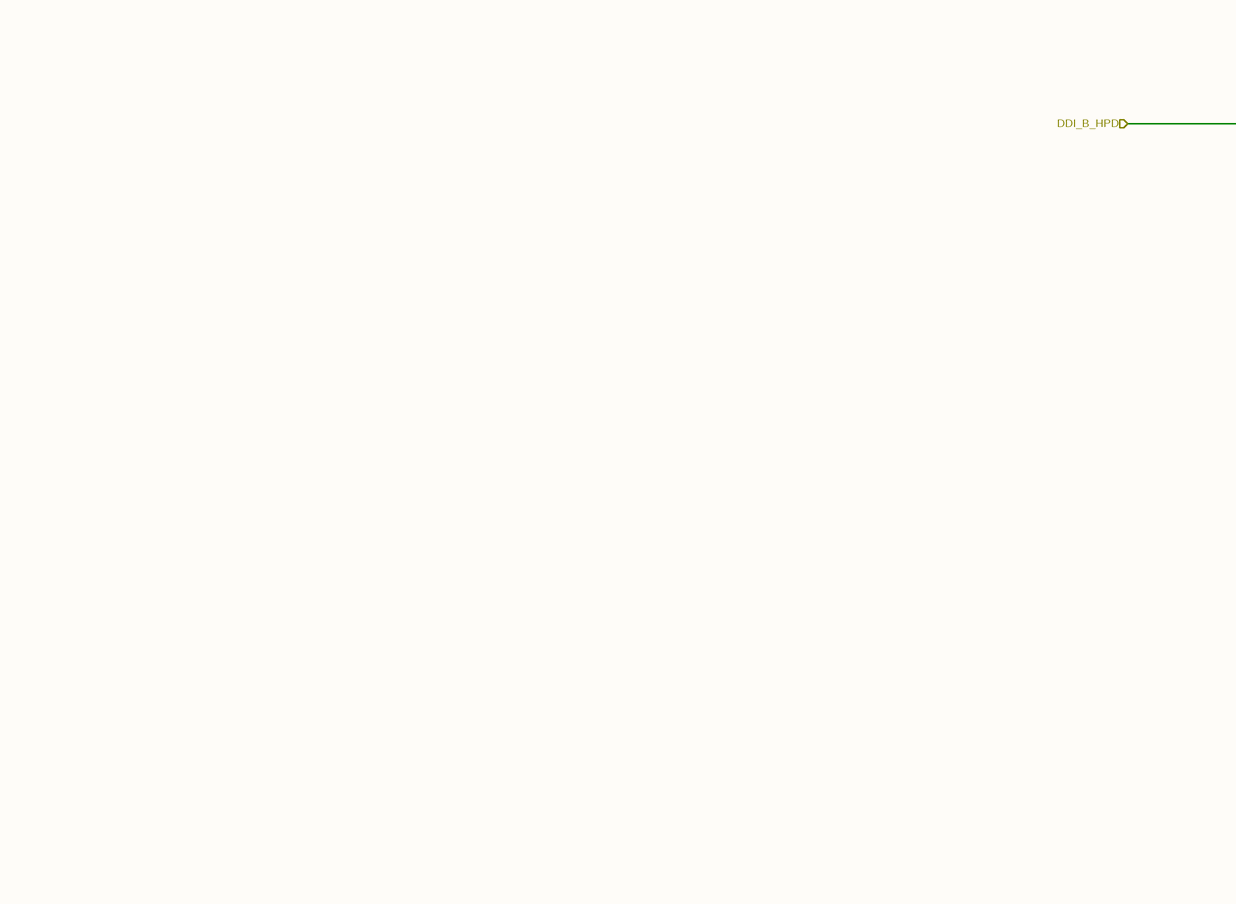
[diagram p8: HDMI.SchDoc, bottom left]
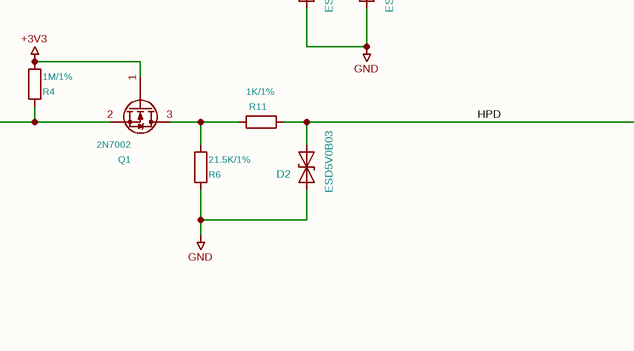
[diagram p9: HDMI.SchDoc, bottom right]

### Parts
(Parts that share a designator on the sheet are numbered #1, #2 ... from top to bottom, then left to right.)
#FLG0401  PWR_FLAG  (graphical)
C17  100nF/50V  [C_0402_1005Metric]
C18  100nF/50V  [C_0402_1005Metric]
C19  100nF/50V  [C_0402_1005Metric]
C20  100nF/50V  [C_0402_1005Metric]
C21  100nF/50V  [C_0402_1005Metric]
C22  100nF/50V  [C_0402_1005Metric]
C23  100nF/50V  [C_0402_1005Metric]
C24  100nF/50V  [C_0402_1005Metric]
C25  100nF/50V  [C_0402_1005Metric]
D1  ESD5V0B03  [D_0402_1005Metric]
D2  ESD5V0B03  [D_0402_1005Metric]
D3  ESD5V0B03  [D_0402_1005Metric]
D4  1N5819WS  [D_SOD-323]
F1  6V/50mA  [R_0603_1608Metric]
J3  HDMI_A  [HDMI_A_Molex_208658-1001_Horizontal]
Q1  2N7002  [SOT-23]
Q2  2SK3018  [SOT-23]
Q3  2SK3018  [SOT-23]
Q4  2SK3018  [SOT-23]
R3  2.2K/1%  [R_0402_1005Metric]
R4  1M/1%  [R_0402_1005Metric]
R5  2.2K/1%  [R_0402_1005Metric]
R6  21.5K/1%  [R_0402_1005Metric]
R7  470R/1%  [R_0402_1005Metric]
R8  470R/1%  [R_0402_1005Metric]
R9  470R/1%  [R_0402_1005Metric]
R10#1  470R/1%  [R_0402_1005Metric]
R11#1  1K/1%  [R_0402_1005Metric]
R13  470R/1%  [R_0402_1005Metric]
R14  470R/1%  [R_0402_1005Metric]
R15  2.2K/1%  [R_0402_1005Metric]
R16  470R/1%  [R_0402_1005Metric]
R17#1  470R/1%  [R_0402_1005Metric]
R18  2.2K/1%  [R_0402_1005Metric]
R19  2.2K/1%  [R_0402_1005Metric]
U1  TPAZ1023-04F  [Diodes_UDFN-10_1.0x2.5mm_P0.5mm]
U2  TPAZ1023-04F  [Diodes_UDFN-10_1.0x2.5mm_P0.5mm]

### Ports
DDI_B_DDC_SCL (out), DDI_B_DDC_SDA (bidir), DDI_B_HPD (in), DDI_B_TX0+ (in), DDI_B_TX0- (in), DDI_B_TX1+ (in), DDI_B_TX1- (in), DDI_B_TX2+ (in), DDI_B_TX2- (in), DDI_B_TX3+ (in), DDI_B_TX3- (in), ~{{PWR_LED}{slash}}{PSON} (in)

### Nets
5V_HDMI_VCC: #FLG0401.1 C25.1 D4.1(K) F1.1 R15.1 R18.1
+3V3: Q1.1(G) Q2.1(G) Q3.1(G) R3.1 R4.1 R5.1
+5V: D4.2(A)
GND: C25.2 D1.1(A1) D2.1(A1) D3.1(A1) J3.2(D2S) J3.5(D1S) J3.8(D0S) J3.11(CKS) J3.17(GND) J3.SH Q4.2(S) R6.2 U1.3(VSS) U2.3(VSS)
DDC_SCL: D1.2(A2) J3.15(SCL) Q2.3(D) R15.2
DDC_SDA: D3.2(A2) J3.16(SDA) Q3.3(D) R18.2
DDI_B_DDC_SCL: Q2.2(S) R5.2 ; port DDI_B_DDC_SCL
DDI_B_DDC_SDA: Q3.2(S) R3.2 ; port DDI_B_DDC_SDA
DDI_B_HPD: Q1.2(S) R4.2 ; port DDI_B_HPD
DDI_B_TX0+: C17.1 ; port DDI_B_TX0+
DDI_B_TX0-: C18.1 ; port DDI_B_TX0-
DDI_B_TX1+: C19.1 ; port DDI_B_TX1+
DDI_B_TX1-: C20.1 ; port DDI_B_TX1-
DDI_B_TX2+: C21.1 ; port DDI_B_TX2+
DDI_B_TX2-: C22.1 ; port DDI_B_TX2-
DDI_B_TX3+: C23.1 ; port DDI_B_TX3+
DDI_B_TX3-: C24.1 ; port DDI_B_TX3-
HPD: D2.2(A2) J3.19(HPD) R11#1.2
TMDS_CK+: C23.2 J3.10(CK+) R8.1 U2.4 U2.7(NC)
TMDS_CK-: C24.2 J3.12(CK-) R7.1 U2.5 U2.6(NC)
TMDS_D0+: C21.2 J3.7(D0+) R10#1.1 U2.1 U2.10(NC)
TMDS_D0-: C22.2 J3.9(D0-) R9.1 U2.2 U2.9(NC)
TMDS_D1+: C19.2 J3.4(D1+) R14.1 U1.4 U1.7(NC)
TMDS_D1-: C20.2 J3.6(D1-) R13.1 U1.5 U1.6(NC)
TMDS_D2+: C17.2 J3.1(D2+) R17#1.1 U1.1 U1.10(NC)
TMDS_D2-: C18.2 J3.3(D2-) R16.1 U1.2 U1.9(NC)
~{{PWR_LED}{slash}}{PSON}: R19.1 ; port ~{{PWR_LED}{slash}}{PSON}
NetF1_2: F1.2 J3.18(+5V)
NetQ1_3: Q1.3(D) R6.1 R11#1.1
NetQ4_1: Q4.1(G) R19.2
NetQ4_3: Q4.3(D) R7.2 R8.2 R9.2 R10#1.2 R13.2 R14.2 R16.2 R17#1.2

Not connected (* = marked no-connect by the designer): J3 13(CEC)* 14(UTILITY)*; U1 8(VSS); U2 8(VSS)

### Notes on the sheet
- 1
- 2
- 3
- 4
- 5
- 6
- 7
- 8
- 9
- 10
- 11
- A
- B
- C
- D
- E
- F
- G
- H
- Title: Primer Carrier for LattePanda Mu
- File: HDMI.kicad_sch
- Sheet: /
- DFRobot
- KiCad E.D.A.  kicad (5.1.4)-1
- Size: A2
- Date: 2024-03-13
- Rev: V1.0.0
- Id: 1/1

### Library data of the parts
C17-C25 = C: SCH_Show_Footprint: C0402; Value: 100nF/50V; Footprint: A_HDJ_Library:C_0402_1005Metric
D1-D3 = ESD9B5.0ST5G: SCH_Show_Footprint: D0402; Value: ESD5V0B03; Footprint: A_HDJ_Library:D_0402_1005Metric
D4 = 1N5819WS: SCH_Show_Footprint: SOD-323; Value: 1N5819WS; Footprint: A_HDJ_Library:D_SOD-323
F1 = Fuse: SCH_Show_Footprint: R0805; Value: 6V/50mA; Footprint: A_HDJ_Library:R_0603_1608Metric
Q2 = 2N7002_2: Value: 2SK3018; Footprint: A_HDJ_Library:SOT-23
Q3 = 2N7002_3: Value: 2SK3018; Footprint: A_HDJ_Library:SOT-23
Q4 = 2N7002_1: Value: 2SK3018; Footprint: A_HDJ_Library:SOT-23
R3-R9 R10#1 R11#1 R13-R16 R17#1 R18 R19 = R: Footprint: A_HDJ_Library:R_0402_1005Metric
  R3 R5 R15 R18 R19: Value: 2.2K/1%
  R4: Value: 1M/1%
  R6: Value: 21.5K/1%
  R7-R9 R10#1 R13 R14 R16 R17#1: Value: 470R/1%
  R11#1: Value: 1K/1%
U1 U2 = D3V3XA4B10LP: Value: TPAZ1023-04F; Footprint: A_HDJ_Library:Diodes_UDFN-10_1.0x2.5mm_P0.5mm
#FLG0401 = PWR_FLAG: Value: PWR_FLAG
J3 = HDMI_A: Value: HDMI_A; Footprint: A_HDJ_Library:HDMI_A_Molex_208658-1001_Horizontal
Q1 = 2N7002: Value: 2N7002; Footprint: A_HDJ_Library:SOT-23

## Sheet PSU.SchDoc
size 594 x 420 mm
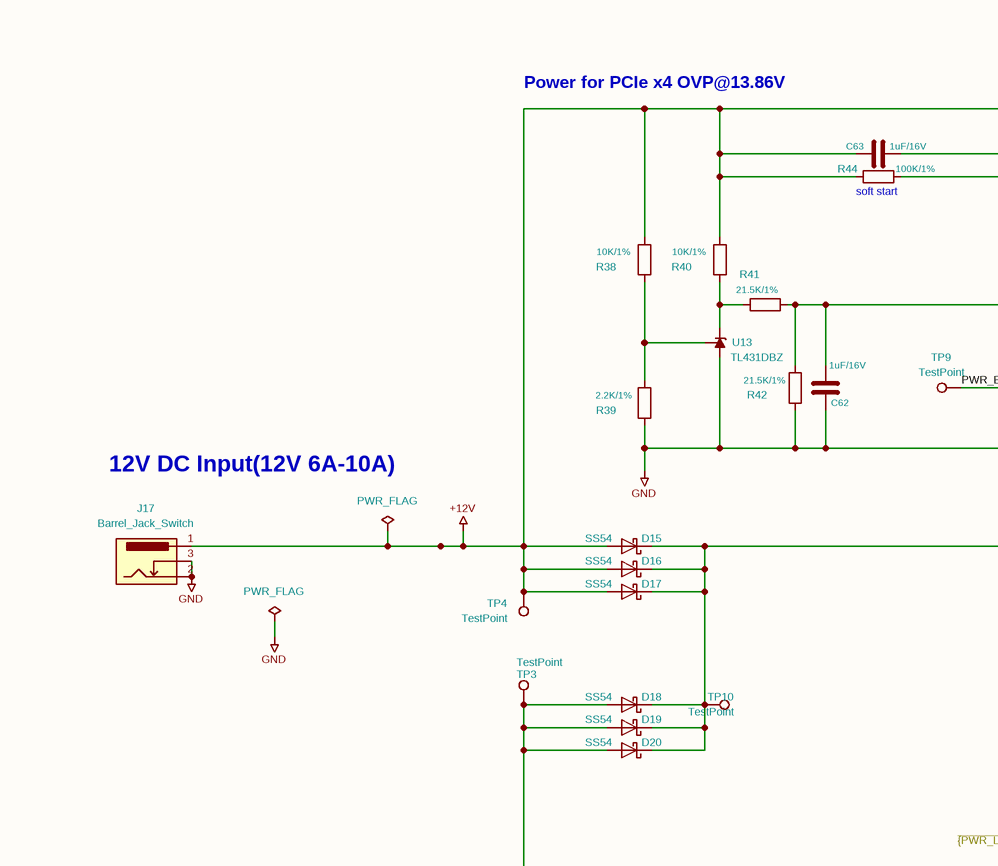
[diagram p10: PSU.SchDoc, top left]
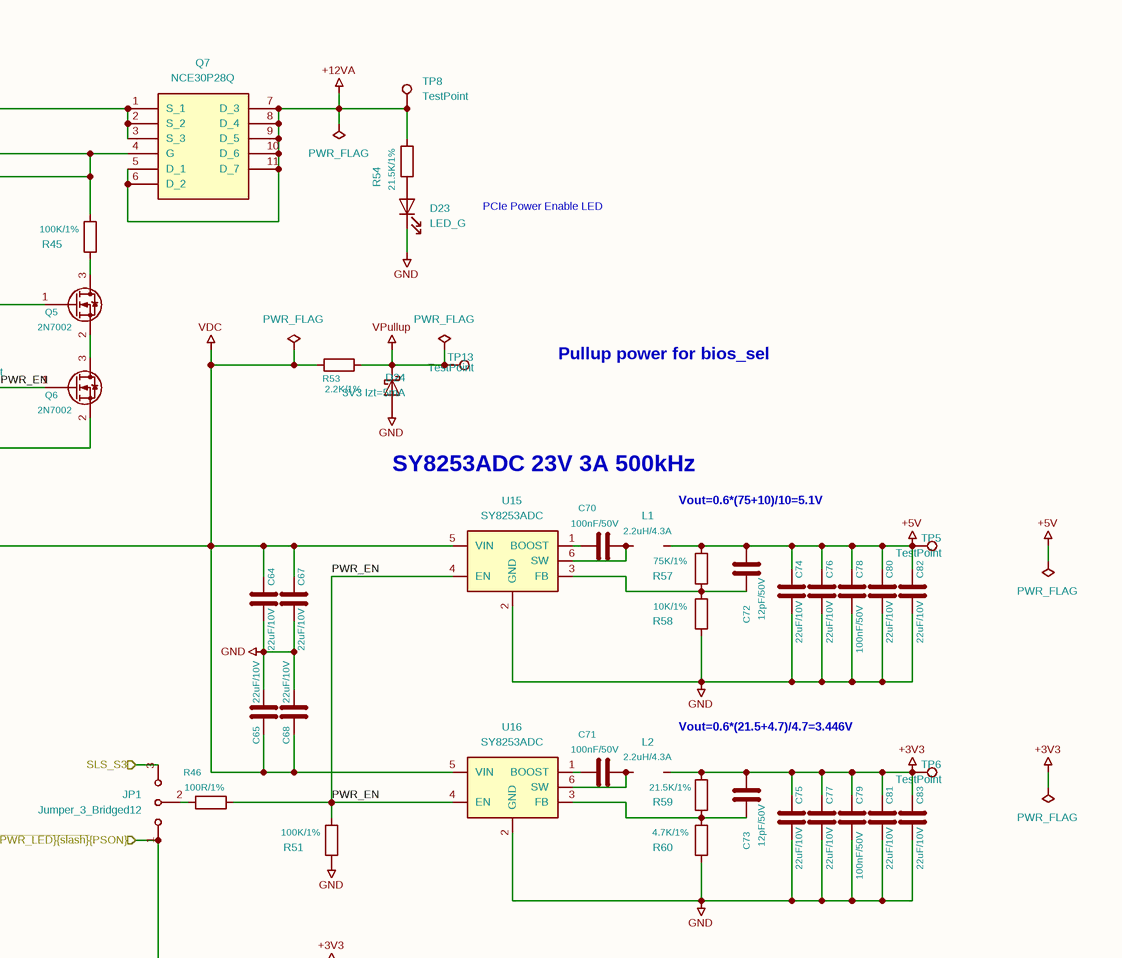
[diagram p11: PSU.SchDoc, top right]
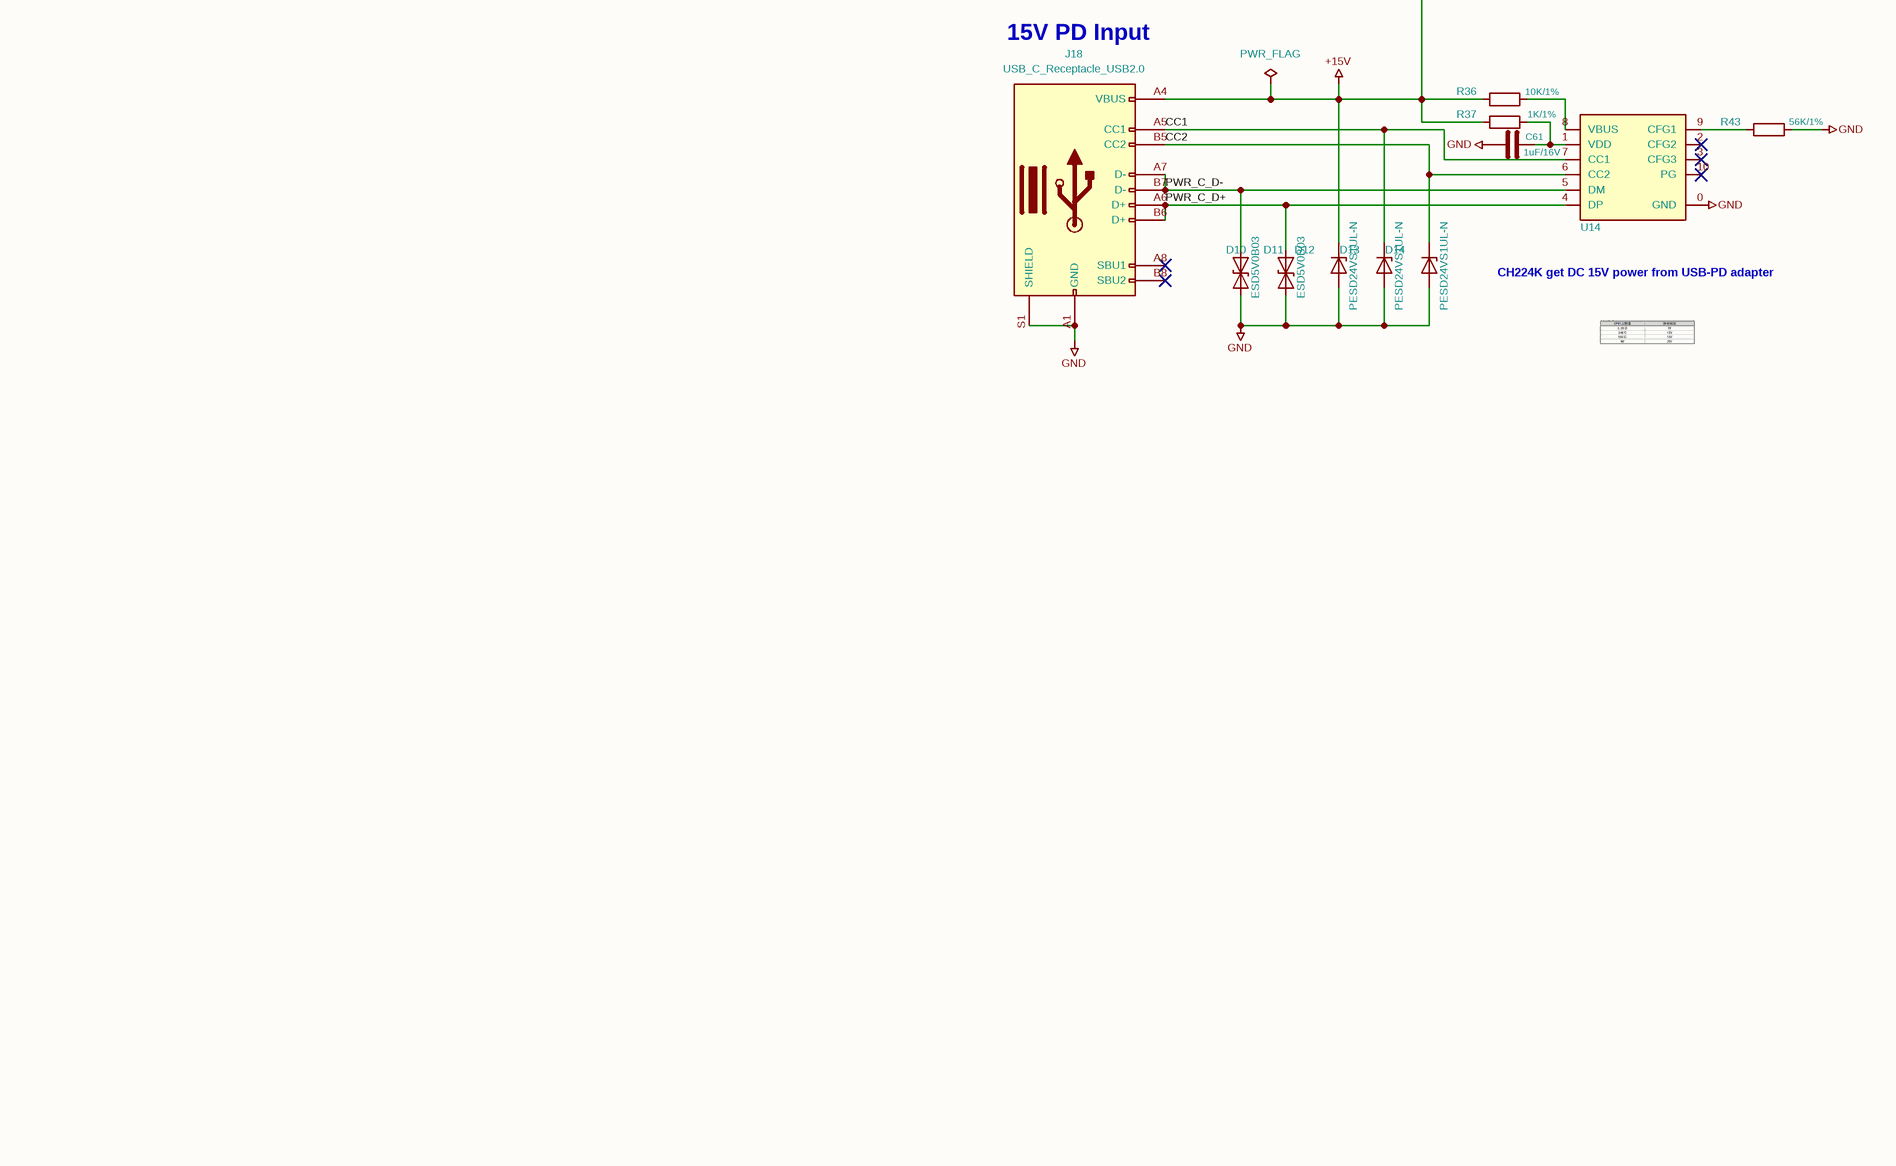
[diagram p12: PSU.SchDoc, bottom left]
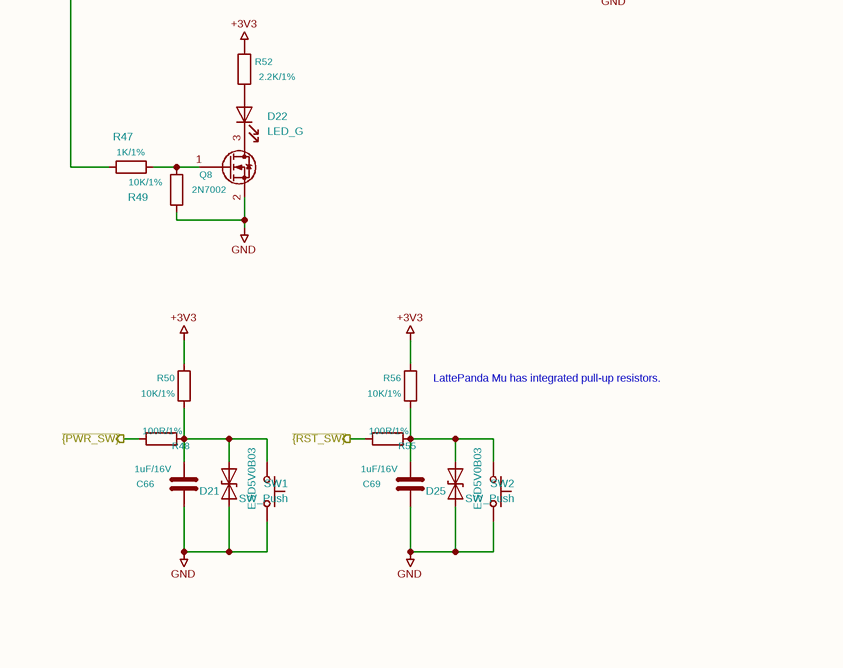
[diagram p13: PSU.SchDoc, bottom right]

### Parts
(Parts that share a designator on the sheet are numbered #1, #2 ... from top to bottom, then left to right.)
#FLG0901  PWR_FLAG  (graphical)
#FLG0902  PWR_FLAG  (graphical)
#FLG0903  PWR_FLAG  (graphical)
#FLG0904  PWR_FLAG  (graphical)
#FLG0905  PWR_FLAG  (graphical)
#FLG0906  PWR_FLAG  (graphical)
#FLG0907  PWR_FLAG  (graphical)
#FLG0908  PWR_FLAG  (graphical)
C61  1uF/16V  [C_0402_1005Metric]
C62  1uF/16V  [C_0402_1005Metric]
C63  1uF/16V  [C_0402_1005Metric]
C64  22uF/10V  [C_0603_1608Metric]
C65  22uF/10V  [C_0603_1608Metric]
C66  1uF/16V  [C_0402_1005Metric]
C67  22uF/10V  [C_0603_1608Metric]
C68  22uF/10V  [C_0603_1608Metric]
C69  1uF/16V  [C_0402_1005Metric]
C70  100nF/50V  [C_0402_1005Metric]
C71  100nF/50V  [C_0402_1005Metric]
C72  12pF/50V  [C_0402_1005Metric]
C73  12pF/50V  [C_0402_1005Metric]
C74#1  22uF/10V  [C_0603_1608Metric]
C75#1  22uF/10V  [C_0603_1608Metric]
C76  22uF/10V  [C_0603_1608Metric]
C77  22uF/10V  [C_0603_1608Metric]
C78  100nF/50V  [C_0402_1005Metric]
C79  100nF/50V  [C_0402_1005Metric]
C80  22uF/10V  [C_0603_1608Metric]
C81  22uF/10V  [C_0603_1608Metric]
C82  22uF/10V  [C_0603_1608Metric]
C83  22uF/10V  [C_0603_1608Metric]
D10  ESD5V0B03  [D_0402_1005Metric]
D11  ESD5V0B03  [D_0402_1005Metric]
D12  PESD24VS1UL-N  [D_0402_1005Metric]
D13  PESD24VS1UL-N  [D_0402_1005Metric]
D14  PESD24VS1UL-N  [D_0402_1005Metric]
D15  SS54  [D_SMA]
D16  SS54  [D_SMA]
D17  SS54  [D_SMA]
D18  SS54  [D_SMA]
D19  SS54  [D_SMA]
D20  SS54  [D_SMA]
D21  ESD5V0B03  [D_0402_1005Metric]
D22  LED_G  [LED_0603_1608Metric]
D23#1  LED_G  [LED_0603_1608Metric]
D24#1  3V3 Izt=5mA  [D_SOD-323]
D25  ESD5V0B03  [D_0402_1005Metric]
J17  Barrel_Jack_Switch  [DC_Jack_DC007B_30V_10A]
J18  USB_C_Receptacle_USB2.0  [USB_C_Receptacle_G-Switch_GT-USB-7010ASV]
JP1  Jumper_3_Bridged12  [PinHeader_1x03_P2.54mm_Vertical]
L1  2.2uH/4.3A  [L_Sunlord_SWPA4020S]
L2  2.2uH/4.3A  [L_Sunlord_SWPA4020S]
Q5  2N7002  [SOT-23]
Q6  2N7002  [SOT-23]
Q7  NCE30P28Q  [MOSFET_PDFN8_3.3x3.3]
Q8  2N7002  [SOT-23]
R36#1  10K/1%  [R_0402_1005Metric]
R37#1  1K/1%  [R_0402_1005Metric]
R38  10K/1%  [R_0402_1005Metric]
R39  2.2K/1%  [R_0402_1005Metric]
R40  10K/1%  [R_0402_1005Metric]
R41  21.5K/1%  [R_0402_1005Metric]
R42  21.5K/1%  [R_0402_1005Metric]
R43  56K/1%  [R_0402_1005Metric]
R44  100K/1%  [R_0402_1005Metric]
R45  100K/1%  [R_0402_1005Metric]
R46  100R/1%  [R_0402_1005Metric]
R47  1K/1%  [R_0402_1005Metric]
R48  100R/1%  [R_0402_1005Metric]
R49  10K/1%  [R_0402_1005Metric]
R50  10K/1%  [R_0402_1005Metric]
R51  100K/1%  [R_0402_1005Metric]
R52  2.2K/1%  [R_0402_1005Metric]
R53  2.2K/1%  [R_0402_1005Metric]
R54#1  21.5K/1%  [R_0402_1005Metric]
R55#1  100R/1%  [R_0402_1005Metric]
R56  10K/1%  [R_0402_1005Metric]
R57  75K/1%  [R_0402_1005Metric]
R58  10K/1%  [R_0402_1005Metric]
R59  21.5K/1%  [R_0402_1005Metric]
R60  4.7K/1%  [R_0402_1005Metric]
SW1  SW_Push  [SW_Push_6x6x6]
SW2  SW_Push  [SW_Push_6x6x6]
TP3  TestPoint  [TestPoint_Pad_D1.5mm]
TP4  TestPoint  [TestPoint_Pad_D1.5mm]
TP5  TestPoint  [TestPoint_Pad_D1.5mm]
TP6  TestPoint  [TestPoint_Pad_D1.5mm]
TP8  TestPoint  [TestPoint_Pad_D1.5mm]
TP9  TestPoint  [TestPoint_Pad_D1.5mm]
TP10  TestPoint  [TestPoint_Pad_D1.5mm]
TP13  TestPoint  [TestPoint_Pad_D1.5mm]
U13  TL431DBZ  [SOT-23]
U14  CH224K  [ESSOP-10-1EP_3.9x5mm_P1.0mm_EP3.2x2.3]  (value not drawn)
U15  SY8253ADC  [TSOT-23-6]
U16  SY8253ADC  [TSOT-23-6]

### Ports
SLS_S3 (in), ~{{PWR_LED}{slash}}{PSON} (in), ~{{PWR_SW}} (out), ~{{RST_SW}} (out)

### Nets
+3V3: #FLG0902.1 C73.1 C75#1.2 C77.2 C79.1 C81.2 C83.2 L2.2 R50.2 R52.2 R56.2 R59.2 TP6.1
+5V: #FLG0901.1 C72.1 C74#1.2 C76.2 C78.1 C80.2 C82.2 L1.2 R57.2 TP5.1
+12V: #FLG0907.1 C63.2 D15.2(A) D16.2(A) D17.2(A) J17.1 Q7.1(S_1) Q7.2(S_2) Q7.3(S_3) R38.2 R40.2 R44.2 TP4.1
+12VA: #FLG0905.1 Q7.5(D_1) Q7.6(D_2) Q7.7(D_3) Q7.8(D_4) Q7.9(D_5) Q7.10(D_6) Q7.11(D_7) R54#1.1 TP8.1
+15V: #FLG0908.1 D12.1(K) D18.2(A) D19.2(A) D20.2(A) J18.A4(VBUS) R36#1.1 R37#1.1 TP3.1
GND: #FLG0903.1 C61.2 C62.2 C64.1 C65.1 C66.2 C67.1 C68.1 C69.2 C74#1.1 C75#1.1 C76.1 C77.1 C78.2 C79.2 C80.1 C81.1 C82.1 C83.1 D10.1(A1) D11.1(A1) D12.2(A) D13.2(A) D14.2(A) D21.1(A1) D23#1.1(K) D24#1.2(A) D25.1(A1) J17.2 J17.3 J18.A1(GND) J18.S1(SHIELD) Q6.2(S) Q8.2(S) R39.1 R42.1 R43.2 R49.1 R51.1 R58.1 R60.1 SW1.2 SW2.2 U13.3(A) U14.0(GND) U15.2(GND) U16.2(GND)
VDC: #FLG0904.1 C64.2 C65.2 C67.2 C68.2 D15.1(K) D16.1(K) D17.1(K) D18.1(K) D19.1(K) D20.1(K) R53.1 TP10.1 U15.5(VIN) U16.5(VIN)
VPullup: #FLG0906.1 D24#1.1(K) R53.2 TP13.1
CC1: D13.1(K) J18.A5(CC1) U14.7(CC1)
CC2: D14.1(K) J18.B5(CC2) U14.6(CC2)
PWR_C_D+: D11.2(A2) J18.A6(D+) J18.B6(D+) U14.4(DP)
PWR_C_D-: D10.2(A2) J18.A7(D-) J18.B7(D-) U14.5(DM)
PWR_EN: Q6.1(G) R46.2 R51.2 TP9.1 U15.4(EN) U16.4(EN)
SLS_S3: JP1.3(B) ; port SLS_S3
~{{PWR_LED}{slash}}{PSON}: JP1.1(A) R47.1 ; port ~{{PWR_LED}{slash}}{PSON}
~{{PWR_SW}}: R48.2 ; port ~{{PWR_SW}}
~{{RST_SW}}: R55#1.2 ; port ~{{RST_SW}}
NetC61_1: C61.1 R37#1.2 U14.1(VDD)
NetC62_1: C62.1 Q5.1(G) R41.1 R42.2
NetC63_1: C63.1 Q7.4(G) R44.1 R45.2
NetC66_1: C66.1 D21.2(A2) R48.1 R50.1 SW1.1
NetC69_1: C69.1 D25.2(A2) R55#1.1 R56.1 SW2.1
NetC70_1: C70.1 L1.1 U15.6(SW)
NetC70_2: C70.2 U15.1(BOOST)
NetC71_1: C71.1 L2.1 U16.6(SW)
NetC71_2: C71.2 U16.1(BOOST)
NetC72_2: C72.2 R57.1 R58.2 U15.3(FB)
NetC73_2: C73.2 R59.1 R60.2 U16.3(FB)
NetD22_1: D22.1(K) Q8.3(D)
NetD22_2: D22.2(A) R52.1
NetD23#1_2: D23#1.2(A) R54#1.2
NetJP1_2: JP1.2(C) R46.1
NetQ5_2: Q5.2(S) Q6.3(D)
NetQ5_3: Q5.3(D) R45.1
NetQ8_1: Q8.1(G) R47.2 R49.2
NetR36#1_2: R36#1.2 U14.8(VBUS)
NetR38_1: R38.1 R39.2 U13.2(REF)
NetR40_1: R40.1 R41.2 U13.1(K)
NetR43_1: R43.1 U14.9(CFG1)

Not connected (* = marked no-connect by the designer): J18 A8(SBU1)* A9(VBUS) A12(GND) B1(GND) B4(VBUS) B8(SBU2)* B9(VBUS) B12(GND); U14 2(CFG2)* 3(CFG3)* 10(PG)*

### Notes on the sheet
- Power for PCIe x4 OVP@13.86V
- (near R44) soft start
- PCIe Power Enable LED
- Pullup power for bios_sel
- 12V DC Input(12V 6A-10A)
- SY8253ADC 23V 3A 500kHz
- Vout=0.6*(75+10)/10=5.1V
- Vout=0.6*(21.5+4.7)/4.7=3.446V
- (near J18) 15V PD Input
- CH224K get DC 15V power from USB-PD adapter
- (near R56) LattePanda Mu has integrated pull-up resistors.
- 1
- 2
- 3
- 4
- 5
- 6
- 7
- 8
- 9
- 10
- 11
- A
- B
- C
- D
- E
- F
- G
- H
- Title: Primer Carrier for LattePanda Mu
- File: PSU.kicad_sch
- Sheet: /
- DFRobot
- KiCad E.D.A.  kicad (5.1.4)-1
- Size: A2
- Date: 2024-03-13
- Rev: V1.0.0
- Id: 1/1

### Library data of the parts
C61-C63 C66 C69-C73 C78 C79 = C: SCH_Show_Footprint: C0402
  C61-C63 C66 C69: Value: 1uF/16V; Footprint: A_HDJ_Library:C_0402_1005Metric
  C70 C71 C78 C79: Value: 100nF/50V; Footprint: A_HDJ_Library:C_0402_1005Metric
  C72 C73: Value: 12pF/50V; Footprint: Capacitor_SMD:C_0402_1005Metric
C64 C65 C67 C68 C74#1 C75#1 C76 C77 C80-C83 = C: SCH_Show_Footprint: C603; Value: 22uF/10V; Footprint: A_HDJ_Library:C_0603_1608Metric
D10 D11 D21 D25 = ESD9B5.0ST5G: SCH_Show_Footprint: D0402; Value: ESD5V0B03; Footprint: A_HDJ_Library:D_0402_1005Metric
D12-D14 = D_Zener: SCH_Show_Footprint: D0402; Value: PESD24VS1UL-N; Footprint: A_HDJ_Library:D_0402_1005Metric
D15-D20 = D_Schottky: SCH_Show_Footprint: SMA; Value: SS54; Footprint: A_HDJ_Library:D_SMA
D22 D23#1 = LED: SCH_Show_Footprint: LED0603; Value: LED_G; Footprint: A_HDJ_Library:LED_0603_1608Metric
D24#1 = D_Schottky: Value: 3V3 Izt=5mA; Footprint: A_HDJ_Library:D_SOD-323
J18 = USB_C_Receptacle_USB2.0_16P: Value: USB_C_Receptacle_USB2.0; Footprint: A_HDJ_Library:USB_C_Receptacle_G-Switch_GT-USB-7010ASV
L1 L2 = L: Value: 2.2uH/4.3A; Footprint: A_HDJ_Library:L_Sunlord_SWPA4020S
Q7 = AON7262E: Value: NCE30P28Q; Footprint: A_HDJ_Library:MOSFET_PDFN8_3.3x3.3
R36#1 R37#1 R38-R53 R54#1 R55#1 R56-R60 = R
  R36#1 R38 R40 R49 R58: Value: 10K/1%; Footprint: A_HDJ_Library:R_0402_1005Metric
  R37#1 R47: Value: 1K/1%; Footprint: A_HDJ_Library:R_0402_1005Metric
  R39 R52 R53: Value: 2.2K/1%; Footprint: A_HDJ_Library:R_0402_1005Metric
  R41 R42 R54#1 R59: Value: 21.5K/1%; Footprint: A_HDJ_Library:R_0402_1005Metric
  R43: Value: 56K/1%; Footprint: A_HDJ_Library:R_0402_1005Metric
  R44 R45 R51: Value: 100K/1%; Footprint: A_HDJ_Library:R_0402_1005Metric
  R46 R48 R55#1: Value: 100R/1%; Footprint: A_HDJ_Library:R_0402_1005Metric
  R50 R56: Value: 10K/1%; Footprint: Resistor_SMD:R_0402_1005Metric
  R57: Value: 75K/1%; Footprint: A_HDJ_Library:R_0402_1005Metric
  R60: Value: 4.7K/1%; Footprint: A_HDJ_Library:R_0402_1005Metric
U15 U16 = LM2734X: Value: SY8253ADC; Footprint: A_HDJ_Library:TSOT-23-6
#FLG0901 #FLG0902 #FLG0903 #FLG0904 #FLG0905 #FLG0906 #FLG0907 #FLG0908 = PWR_FLAG: Value: PWR_FLAG
J17 = Barrel_Jack_Switch: Value: Barrel_Jack_Switch; Footprint: A_HDJ_Library:DC_Jack_DC007B_30V_10A
JP1 = Jumper_3_Bridged12: Value: Jumper_3_Bridged12; Footprint: A_HDJ_Library:PinHeader_1x03_P2.54mm_Vertical
Q5 Q6 Q8 = 2N7002: Value: 2N7002; Footprint: A_HDJ_Library:SOT-23
SW1 SW2 = SW_Push: Value: SW_Push; Footprint: A_HDJ_Library:SW_Push_6x6x6
TP3-TP6 TP8-TP10 TP13 = TestPoint: Value: TestPoint; Footprint: A_HDJ_Library:TestPoint_Pad_D1.5mm
U13 = TL431DBZ: Value: TL431DBZ; Footprint: A_HDJ_Library:SOT-23
U14 = CH224K: Value: CH224K; Footprint: A_HDJ_Library:ESSOP-10-1EP_3.9x5mm_P1.0mm_EP3.2x2.3

## Sheet M.2 E&M Key.SchDoc
size 594 x 420 mm
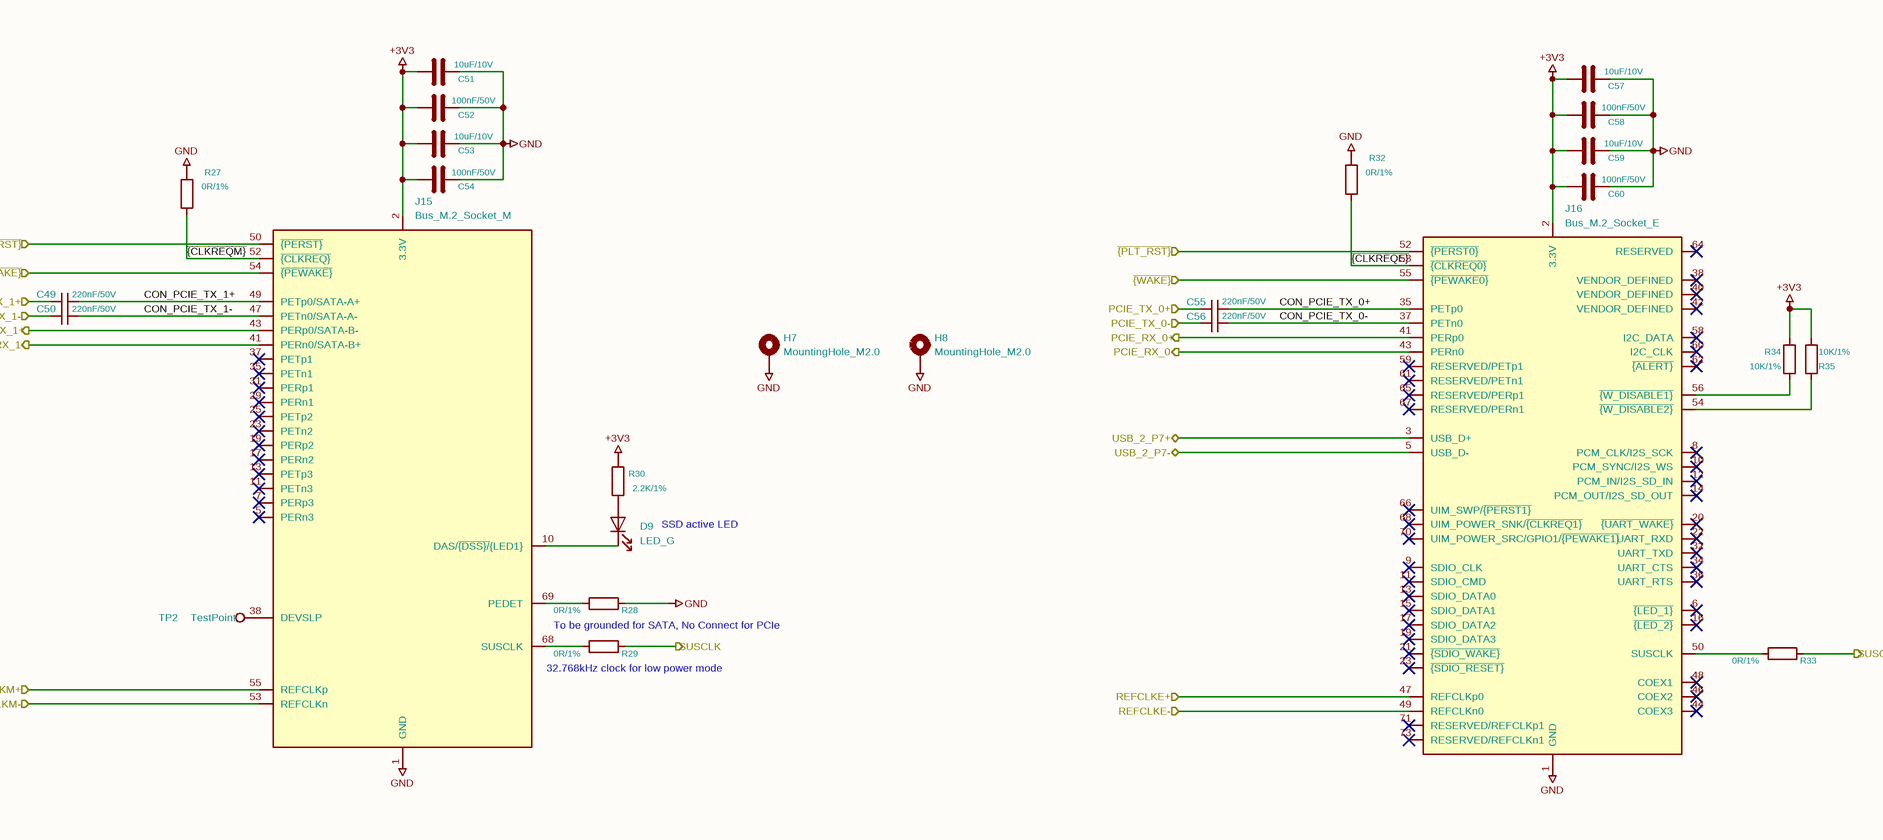
[diagram p14: M.2 E&M Key.SchDoc]

### Parts
(Parts that share a designator on the sheet are numbered #1, #2 ... from top to bottom, then left to right.)
C49  220nF/50V  [C_0402_1005Metric]
C50  220nF/50V  [C_0402_1005Metric]
C51  10uF/10V  [C_0402_1005Metric]
C52  100nF/50V  [C_0402_1005Metric]
C53  10uF/10V  [C_0402_1005Metric]
C54  100nF/50V  [C_0402_1005Metric]
C55  220nF/50V  [C_0402_1005Metric]
C56  220nF/50V  [C_0402_1005Metric]
C57  10uF/10V  [C_0402_1005Metric]
C58  100nF/50V  [C_0402_1005Metric]
C59  10uF/10V  [C_0402_1005Metric]
C60  100nF/50V  [C_0402_1005Metric]
D9  LED_G  [LED_0603_1608Metric]
H7  MountingHole_M2.0  [MountingHole_2.75mm_M2_4.4mm_Pad_TopOnly]
H8  MountingHole_M2.0  [MountingHole_2.75mm_M2_4.4mm_Pad_TopOnly]
J15  Bus_M.2_Socket_M  [PCIe_M.2_Connectors_P=0.5mm_H=4.2mm_KeyM]
J16  Bus_M.2_Socket_E  [PCIe_M.2_Connectors_P=0.5mm_H=4.2mm_KeyE]
R27  0R/1%  [R_0402_1005Metric]
R28  0R/1%  [R_0402_1005Metric]
R29#1  0R/1%  [R_0402_1005Metric]
R30#1  2.2K/1%  [R_0402_1005Metric]
R32#1  0R/1%  [R_0402_1005Metric]
R33#1  0R/1%  [R_0402_1005Metric]
R34#1  10K/1%  [R_0402_1005Metric]
R35#1  10K/1%  [R_0402_1005Metric]
TP2  TestPoint  [TestPoint_Pad_D1.5mm]

### Ports
PCIE_RX_0+ (out), PCIE_RX_0- (out), PCIE_RX_1+ (out), PCIE_RX_1- (out), PCIE_TX_0+ (in), PCIE_TX_0- (in), PCIE_TX_1+ (in), PCIE_TX_1- (in), REFCLKE+ (in), REFCLKE- (in), REFCLKM+ (in), REFCLKM- (in), SUSCLK (out), USB_2_P7+ (bidir), USB_2_P7- (bidir), ~{{PLT_RST}} (in), ~{{WAKE}} (in)

### Nets
+3V3: C51.2 C52.2 C53.2 C54.2 C57.2 C58.2 C59.2 C60.2 J15.2(3.3V) J16.2(3.3V) R30#1.2 R34#1.2 R35#1.1
GND: C51.1 C52.1 C53.1 C54.1 C57.1 C58.1 C59.1 C60.1 H7.1 H8.1 J15.1(GND) J16.1(GND) R27.2 R28.2 R32#1.2
CON_PCIE_TX_0+: C55.2 J16.35(PETp0)
CON_PCIE_TX_0-: C56.2 J16.37(PETn0)
CON_PCIE_TX_1+: C49.2 J15.49(PETp0/SATA-A+)
CON_PCIE_TX_1-: C50.2 J15.47(PETn0/SATA-A-)
PCIE_RX_0+: J16.41(PERp0) ; port PCIE_RX_0+
PCIE_RX_0-: J16.43(PERn0) ; port PCIE_RX_0-
PCIE_RX_1+: J15.43(PERp0/SATA-B-) ; port PCIE_RX_1+
PCIE_RX_1-: J15.41(PERn0/SATA-B+) ; port PCIE_RX_1-
PCIE_TX_0+: C55.1 ; port PCIE_TX_0+
PCIE_TX_0-: C56.1 ; port PCIE_TX_0-
PCIE_TX_1+: C49.1 ; port PCIE_TX_1+
PCIE_TX_1-: C50.1 ; port PCIE_TX_1-
REFCLKE+: J16.47(REFCLKp0) ; port REFCLKE+
REFCLKE-: J16.49(REFCLKn0) ; port REFCLKE-
REFCLKM+: J15.55(REFCLKp) ; port REFCLKM+
REFCLKM-: J15.53(REFCLKn) ; port REFCLKM-
SUSCLK: R29#1.2 R33#1.2 ; port SUSCLK
USB_2_P7+: J16.3(USB_D+) ; port USB_2_P7+
USB_2_P7-: J16.5(USB_D-) ; port USB_2_P7-
~{{CLKREQE}}: J16.53(~{{CLKREQ0}}) R32#1.1
~{{CLKREQM}}: J15.52(~{{CLKREQ}}) R27.1
~{{PLT_RST}}: J15.50(~{{PERST}}) J16.52(~{{PERST0}}) ; port ~{{PLT_RST}}
~{{WAKE}}: J15.54(~{{PEWAKE}}) J16.55(~{{PEWAKE0}}) ; port ~{{WAKE}}
NetD9_1: D9.1(K) J15.10(DAS/~{{DSS}/}{LED1})
NetD9_2: D9.2(A) R30#1.1
NetJ15_38: J15.38(DEVSLP) TP2.1
NetJ15_68: J15.68(SUSCLK) R29#1.1
NetJ15_69: J15.69(PEDET) R28.1
NetJ16_50: J16.50(SUSCLK) R33#1.1
NetJ16_54: J16.54(~{{W_DISABLE2}}) R35#1.2
NetJ16_56: J16.56(~{{W_DISABLE1}}) R34#1.1

Not connected (* = marked no-connect by the designer): J15 3(GND) 4(3.3V) 5(PERn3)* 6(NC) 7(PERp3)* 8(NC) 9(GND) 11(PETn3)* 12(3.3V) 13(PETp3)* 14(3.3V) 15(GND) 16(3.3V) 17(PERn2)* 18(3.3V) 19(PERp2)* 20(NC) 21(GND) 22(NC) 23(PETn2)* 24(NC) 25(PETp2)* 26(NC) 27(GND) 28(NC) 29(PERn1)* 30(NC) 31(PERp1)* 32(NC) 33(GND) 34(NC) 35(PETn1)* 36(NC) 37(PETp1)* 39(GND) 40(NC) 42(NC) 44(NC) 45(GND) 46(NC) 48(NC) 51(GND) 56(NC) 57(GND) 58(NC) 67(NC) 70(3.3V) 71(GND) 72(3.3V) 73(GND) 74(3.3V) 75(GND) MP1 MP2; J16 4(3.3V) 6(~{{LED_1}})* 7(GND) 8(PCM_CLK/I2S_SCK)* 9(SDIO_CLK)* 10(PCM_SYNC/I2S_WS)* 11(SDIO_CMD)* 12(PCM_IN/I2S_SD_IN)* 13(SDIO_DATA0)* 14(PCM_OUT/I2S_SD_OUT)* 15(SDIO_DATA1)* 16(~{{LED_2}})* 17(SDIO_DATA2)* 18(GND) 19(SDIO_DATA3)* 20(~{{UART_WAKE}})* 21(~{{SDIO_WAKE}})* 22(UART_RXD)* 23(~{{SDIO_RESET}})* 32(UART_TXD)* 33(GND) 34(UART_CTS)* 36(UART_RTS)* 38(VENDOR_DEFINED)* 39(GND) 40(VENDOR_DEFINED)* 42(VENDOR_DEFINED)* 44(COEX3)* 45(GND) 46(COEX2)* 48(COEX1)* 51(GND) 57(GND) 58(I2C_DATA)* 59(RESERVED/PETp1)* 60(I2C_CLK)* 61(RESERVED/PETn1)* 62(~{{ALERT}})* 63(GND) 64(RESERVED)* 65(RESERVED/PERp1)* 66(UIM_SWP/~{{PERST1}})* 67(RESERVED/PERn1)* 68(UIM_POWER_SNK/~{{CLKREQ1}})* 69(GND) 70(UIM_POWER_SRC/GPIO1/~{{PEWAKE1}})* 71(RESERVED/REFCLKp1)* 72(3.3V) 73(RESERVED/REFCLKn1)* 74(3.3V) 75(GND) MP1 MP2

### Notes on the sheet
- SSD active LED
- To be grounded for SATA, No Connect for PCIe
- 32.768kHz clock for low power mode
- 1
- 2
- 3
- 4
- 5
- 6
- 7
- 8
- 9
- 10
- 11
- A
- B
- C
- D
- E
- F
- G
- H
- Title: Primer Carrier for LattePanda Mu
- File: M.2 E&M Key.kicad_sch
- Sheet: /
- DFRobot
- KiCad E.D.A.  kicad (5.1.4)-1
- Size: A2
- Date: 2024-03-13
- Rev: V1.0.0
- Id: 1/1

### Library data of the parts
C49 C50 C55 C56 = C_Small: SCH_Show_Footprint: C0402; Value: 220nF/50V; Footprint: A_HDJ_Library:C_0402_1005Metric
C51-C54 C57-C60 = C: SCH_Show_Footprint: C0402; Footprint: A_HDJ_Library:C_0402_1005Metric
  C51 C53 C57 C59: Value: 10uF/10V
  C52 C54 C58 C60: Value: 100nF/50V
D9 = LED: SCH_Show_Footprint: LED0603; Value: LED_G; Footprint: A_HDJ_Library:LED_0603_1608Metric
H7 H8 = MountingHole_Pad: Value: MountingHole_M2.0; Footprint: A_HDJ_Library:MountingHole_2.75mm_M2_4.4mm_Pad_TopOnly
R27 R28 R29#1 R30#1 R32#1 R33#1 R34#1 R35#1 = R
  R27 R29#1 R32#1 R33#1: Value: 0R/1%; Footprint: A_HDJ_Library:R_0402_1005Metric
  R28: Value: 0R/1%; Footprint: Resistor_SMD:R_0402_1005Metric
  R30#1: Value: 2.2K/1%; Footprint: A_HDJ_Library:R_0402_1005Metric
  R34#1 R35#1: Value: 10K/1%; Footprint: A_HDJ_Library:R_0402_1005Metric
J15 = Bus_M.2_Socket_M: Value: Bus_M.2_Socket_M; Footprint: A_HDJ_Library:PCIe_M.2_Connectors_P=0.5mm_H=4.2mm_KeyM
J16 = Bus_M.2_Socket_E: Value: Bus_M.2_Socket_E; Footprint: A_HDJ_Library:PCIe_M.2_Connectors_P=0.5mm_H=4.2mm_KeyE
TP2 = TestPoint: Value: TestPoint; Footprint: A_HDJ_Library:TestPoint_Pad_D1.5mm

## Sheet Gigabit Ethernet.SchDoc
size 594 x 420 mm
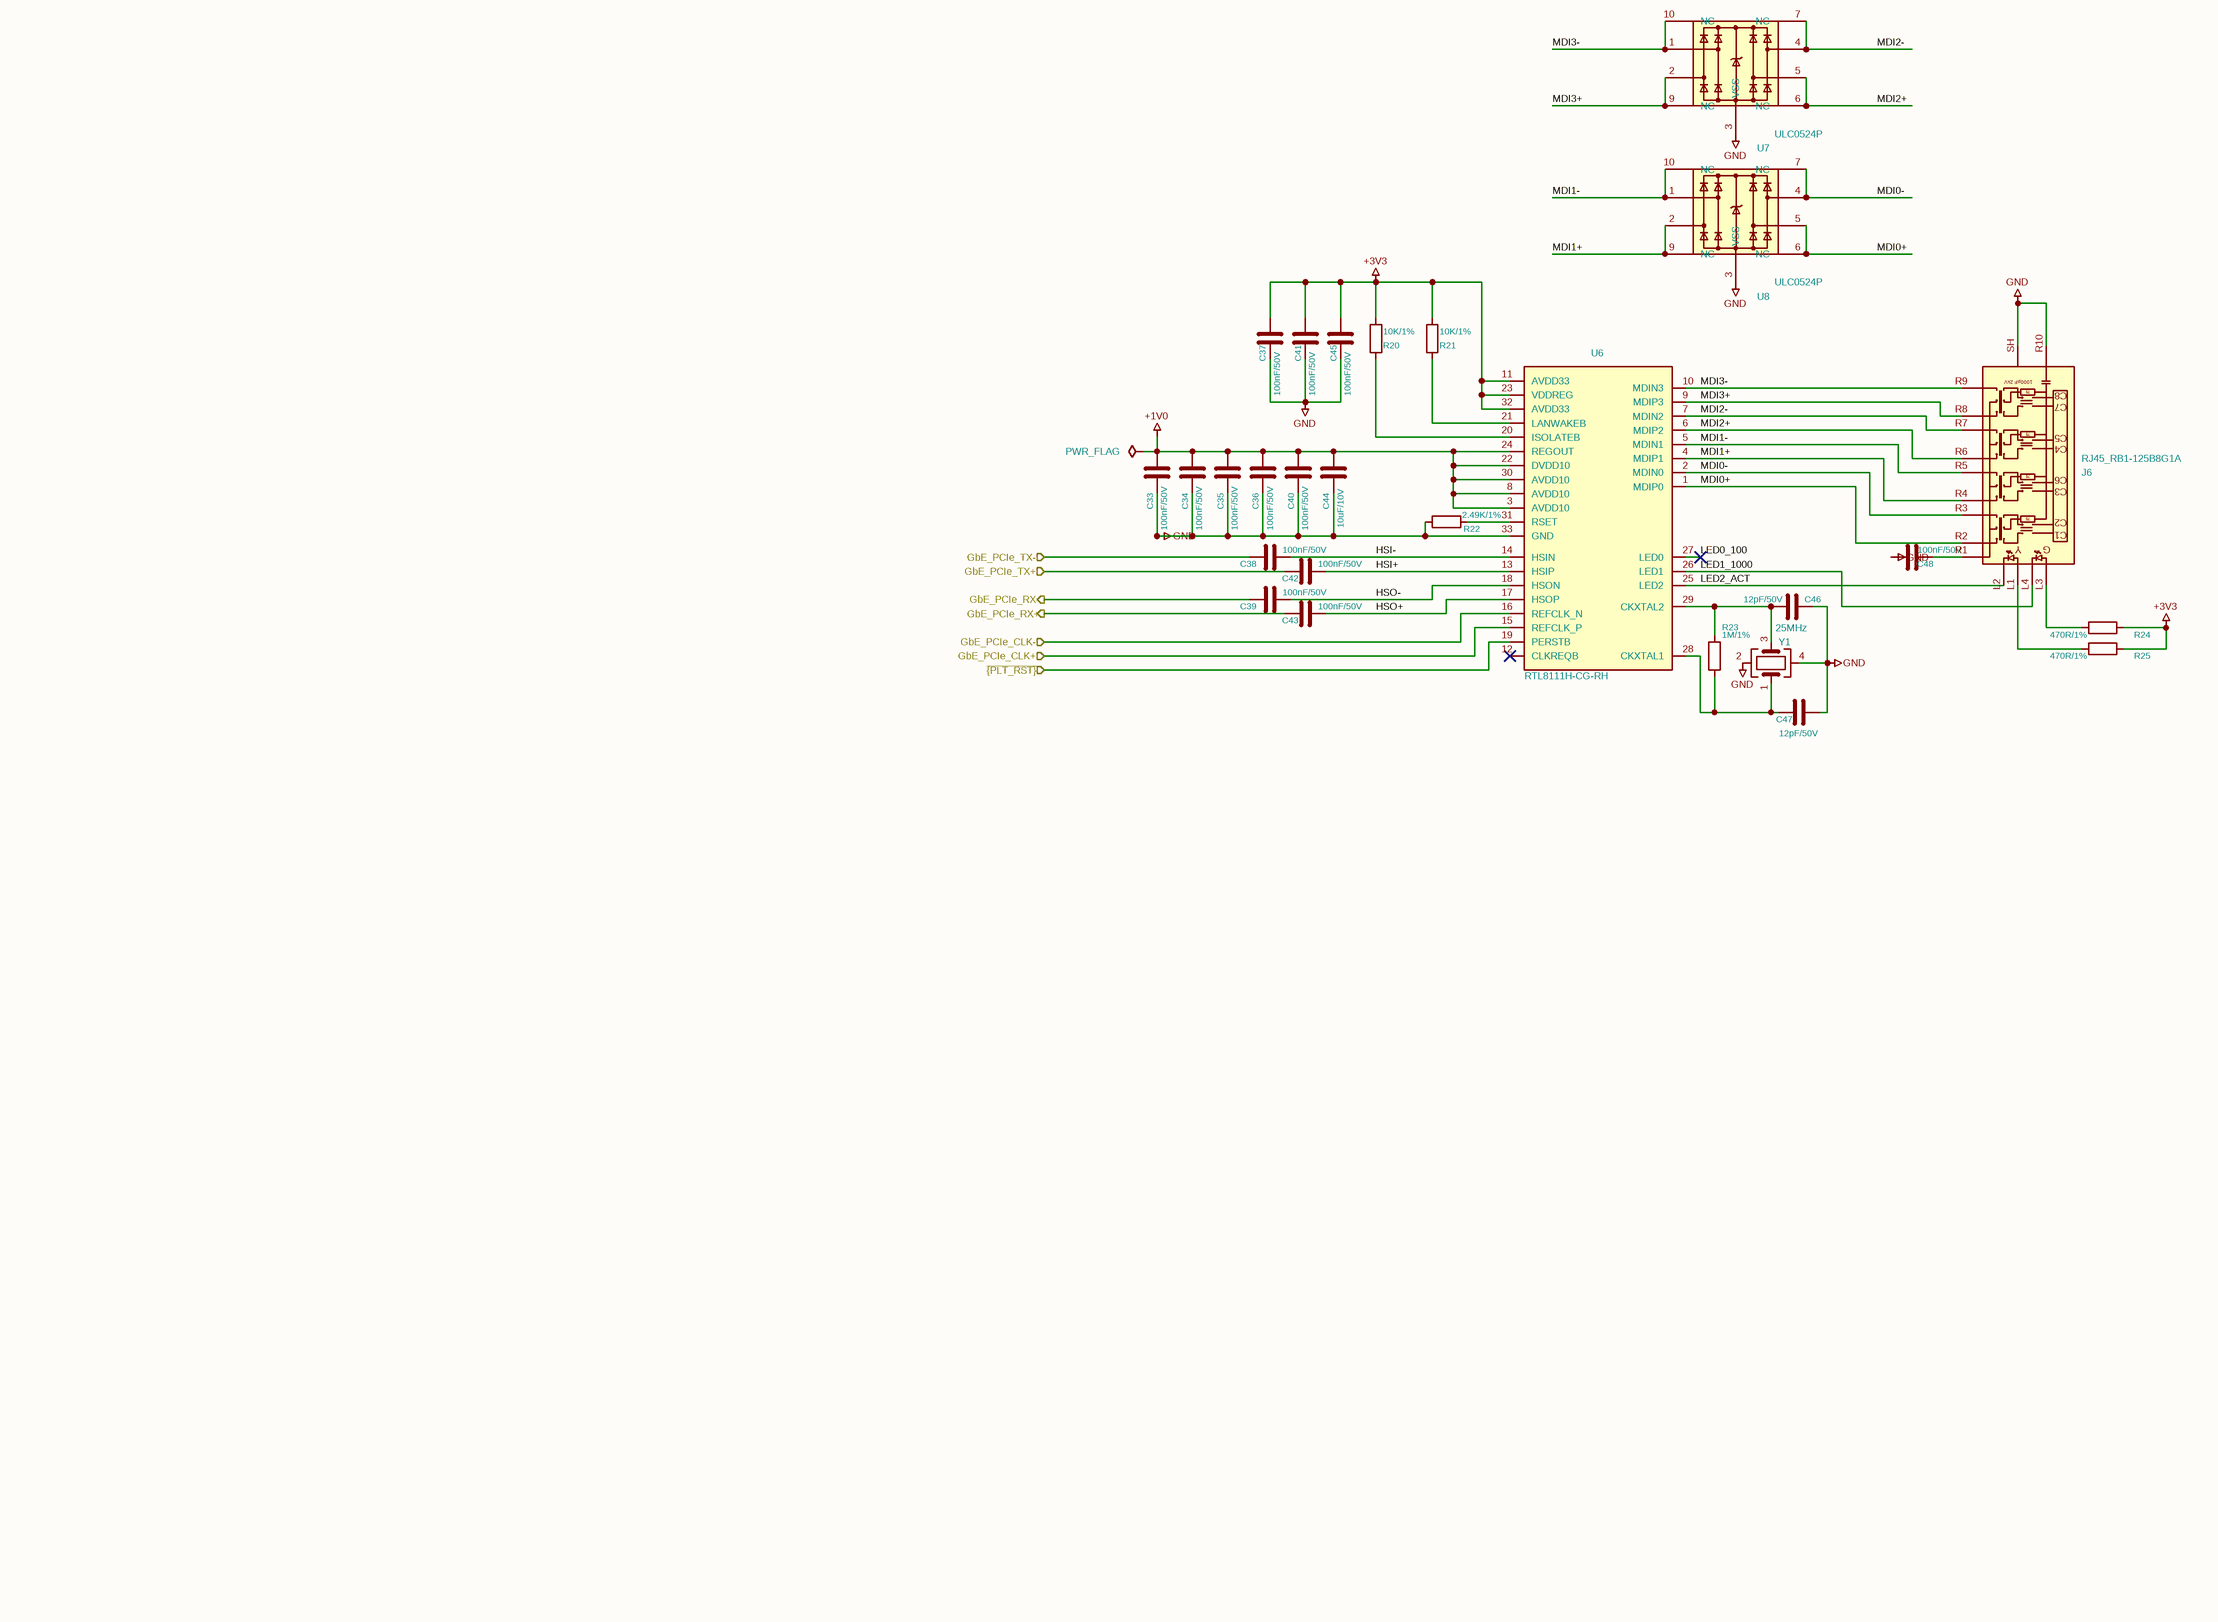
[diagram p15: Gigabit Ethernet.SchDoc]

### Parts
#FLG0601  PWR_FLAG  (graphical)
C33  100nF/50V  [C_0402_1005Metric]
C34  100nF/50V  [C_0402_1005Metric]
C35  100nF/50V  [C_0402_1005Metric]
C36  100nF/50V  [C_0402_1005Metric]
C37  100nF/50V  [C_0402_1005Metric]
C38  100nF/50V  [C_0402_1005Metric]
C39  100nF/50V  [C_0402_1005Metric]
C40  100nF/50V  [C_0402_1005Metric]
C41  100nF/50V  [C_0402_1005Metric]
C42  100nF/50V  [C_0402_1005Metric]
C43  100nF/50V  [C_0402_1005Metric]
C44  10uF/10V  [C_0402_1005Metric]
C45  100nF/50V  [C_0402_1005Metric]
C46  12pF/50V  [C_0402_1005Metric]
C47  12pF/50V  [C_0402_1005Metric]
C48  100nF/50V  [C_0402_1005Metric]
J6  RJ45_RB1-125B8G1A  [RJ45_UDE_RB1-125B8G1A]
R20  10K/1%  [R_0402_1005Metric]
R21  10K/1%  [R_0402_1005Metric]
R22  2.49K/1%  [R_0603_1608Metric]
R23  1M/1%  [R_0402_1005Metric]
R24  470R/1%  [R_0402_1005Metric]
R25  470R/1%  [R_0402_1005Metric]
U6  RTL8111H-CG-RH  [QFN-32-1EP_4x4mm_P0.4mm_EP2.65x2.65mm]
U7  ULC0524P  [Diodes_UDFN-10_1.0x2.5mm_P0.5mm]
U8  ULC0524P  [Diodes_UDFN-10_1.0x2.5mm_P0.5mm]
Y1  25MHz  [Crystal_SMD_3225-4Pin_3.2x2.5mm]

### Ports
GbE_PCIe_CLK+ (in), GbE_PCIe_CLK- (in), GbE_PCIe_RX+ (out), GbE_PCIe_RX- (out), GbE_PCIe_TX+ (in), GbE_PCIe_TX- (in), ~{{PLT_RST}} (in)

### Nets
+1V0: #FLG0601.1 C33.2 C34.2 C35.2 C36.2 C40.2 C44.2 U6.3(AVDD10) U6.8(AVDD10) U6.22(DVDD10) U6.24(REGOUT) U6.30(AVDD10)
+3V3: C37.2 C41.2 C45.2 R20.1 R21.1 R24.2 R25.2 U6.11(AVDD33) U6.23(VDDREG) U6.32(AVDD33)
GND: C33.1 C34.1 C35.1 C36.1 C37.1 C40.1 C41.1 C44.1 C45.1 C46.1 C47.1 C48.2 J6.R10(GND) J6.SH R22.1 U6.33(GND) U7.3(VSS) U8.3(VSS) Y1.2 Y1.4
GbE_PCIe_CLK+: U6.15(REFCLK_P) ; port GbE_PCIe_CLK+
GbE_PCIe_CLK-: U6.16(REFCLK_N) ; port GbE_PCIe_CLK-
GbE_PCIe_RX+: C43.2 ; port GbE_PCIe_RX+
GbE_PCIe_RX-: C39.2 ; port GbE_PCIe_RX-
GbE_PCIe_TX+: C42.2 ; port GbE_PCIe_TX+
GbE_PCIe_TX-: C38.2 ; port GbE_PCIe_TX-
HSI+: C42.1 U6.13(HSIP)
HSI-: C38.1 U6.14(HSIN)
HSO+: C43.1 U6.17(HSOP)
HSO-: C39.1 U6.18(HSON)
LED0_100: U6.27(LED0)
LED1_1000: J6.L4 U6.26(LED1)
LED2_ACT: J6.L2 U6.25(LED2)
MDI0+: J6.R2(TD1+) U6.1(MDIP0) U8.5 U8.6(NC)
MDI0-: J6.R3(TD1-) U6.2(MDIN0) U8.4 U8.7(NC)
MDI1+: J6.R4(TD2+) U6.4(MDIP1) U8.2 U8.9(NC)
MDI1-: J6.R5(TD2-) U6.5(MDIN1) U8.1 U8.10(NC)
MDI2+: J6.R6(TD3+) U6.6(MDIP2) U7.5 U7.6(NC)
MDI2-: J6.R7(TD3-) U6.7(MDIN2) U7.4 U7.7(NC)
MDI3+: J6.R8(TD4+) U6.9(MDIP3) U7.2 U7.9(NC)
MDI3-: J6.R9(TD4-) U6.10(MDIN3) U7.1 U7.10(NC)
~{{PLT_RST}}: U6.19(PERSTB) ; port ~{{PLT_RST}}
NetC46_2: C46.2 R23.1 U6.29(CKXTAL2) Y1.3
NetC47_2: C47.2 R23.2 U6.28(CKXTAL1) Y1.1
NetC48_1: C48.1 J6.R1(CT)
NetJ6_L1: J6.L1 R25.1
NetJ6_L3: J6.L3 R24.1
NetR20_2: R20.2 U6.20(ISOLATEB)
NetR21_2: R21.2 U6.21(LANWAKEB)
NetR22_2: R22.2 U6.31(RSET)

Not connected (* = marked no-connect by the designer): U6 12(CLKREQB)*; U7 8(VSS); U8 8(VSS)

### Notes on the sheet
- 1
- 2
- 3
- 4
- 5
- 6
- 7
- 8
- 9
- 10
- 11
- A
- B
- C
- D
- E
- F
- G
- H
- Title: Primer Carrier for LattePanda Mu
- File: Gigabit Ethernet.kicad_sch
- Sheet: /
- DFRobot
- KiCad E.D.A.  kicad (5.1.4)-1
- Size: A2
- Date: 2024-03-13
- Rev: V1.0.0
- Id: 1/1
- (in symbol RJ45_RB1-125B8G1A) 1000pF 2kV; 75; C8; C7; C5; C4; C6; C3; C2; C1; Y; G

### Library data of the parts
C33-C48 = C: SCH_Show_Footprint: C0402; Footprint: A_HDJ_Library:C_0402_1005Metric
  C33-C43 C45 C48: Value: 100nF/50V
  C44: Value: 10uF/10V
  C46 C47: Value: 12pF/50V
R20-R25 = R
  R20 R21: Value: 10K/1%; Footprint: A_HDJ_Library:R_0402_1005Metric
  R22: Value: 2.49K/1%; Footprint: A_HDJ_Library:R_0603_1608Metric
  R23: Value: 1M/1%; Footprint: A_HDJ_Library:R_0402_1005Metric
  R24 R25: Value: 470R/1%; Footprint: A_HDJ_Library:R_0402_1005Metric
U7 U8 = D3V3XA4B10LP: Value: ULC0524P; Footprint: Package_DFN_QFN:Diodes_UDFN-10_1.0x2.5mm_P0.5mm
Y1 = Crystal_GND24: Value: 25MHz; Footprint: A_HDJ_Library:Crystal_SMD_3225-4Pin_3.2x2.5mm
#FLG0601 = PWR_FLAG: Value: PWR_FLAG
J6 = RJ45_RB1-125B8G1A: Value: RJ45_RB1-125B8G1A; Footprint: A_HDJ_Library:RJ45_UDE_RB1-125B8G1A
U6 = RTL8111H-CG-RH: Value: RTL8111H-CG-RH; Footprint: A_HDJ_Library:QFN-32-1EP_4x4mm_P0.4mm_EP2.65x2.65mm

## Sheet GPIO.SchDoc
size 594 x 420 mm
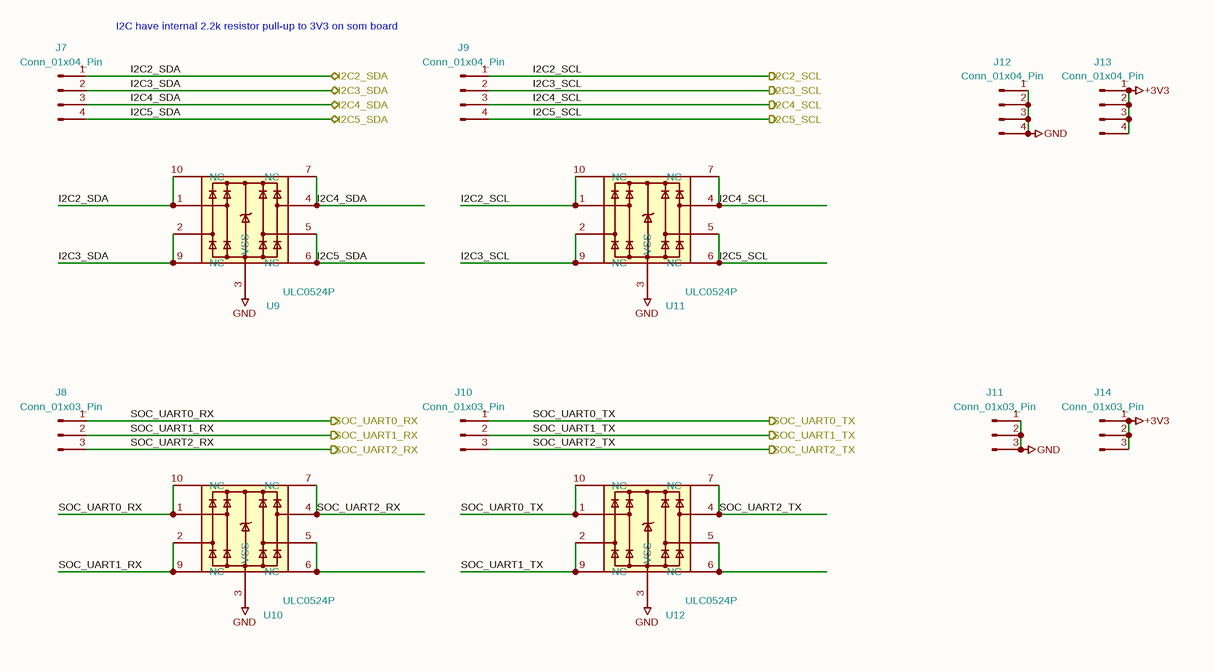
[diagram p16: GPIO.SchDoc]

### Parts
J7  Conn_01x04_Pin  [PinHeader_1x04_P2.54mm_Vertical]
J8  Conn_01x03_Pin  [PinHeader_1x03_P2.54mm_Vertical]
J9  Conn_01x04_Pin  [PinHeader_1x04_P2.54mm_Vertical]
J10  Conn_01x03_Pin  [PinHeader_1x03_P2.54mm_Vertical]
J11  Conn_01x03_Pin  [PinHeader_1x03_P2.54mm_Vertical]
J12  Conn_01x04_Pin  [PinHeader_1x04_P2.54mm_Vertical]
J13  Conn_01x04_Pin  [PinHeader_1x04_P2.54mm_Vertical]
J14  Conn_01x03_Pin  [PinHeader_1x03_P2.54mm_Vertical]
U9  ULC0524P  [Diodes_UDFN-10_1.0x2.5mm_P0.5mm]
U10  ULC0524P  [Diodes_UDFN-10_1.0x2.5mm_P0.5mm]
U11  ULC0524P  [Diodes_UDFN-10_1.0x2.5mm_P0.5mm]
U12  ULC0524P  [Diodes_UDFN-10_1.0x2.5mm_P0.5mm]

### Ports
I2C2_SCL (out), I2C2_SDA (bidir), I2C3_SCL (out), I2C3_SDA (bidir), I2C4_SCL (out), I2C4_SDA (bidir), I2C5_SCL (out), I2C5_SDA (bidir), SOC_UART0_RX (out), SOC_UART0_TX (out), SOC_UART1_RX (out), SOC_UART1_TX (out), SOC_UART2_RX (out), SOC_UART2_TX (out)

### Nets
+3V3: J13.1(Pin_1) J13.2(Pin_2) J13.3(Pin_3) J13.4(Pin_4) J14.1(Pin_1) J14.2(Pin_2) J14.3(Pin_3)
GND: J11.1(Pin_1) J11.2(Pin_2) J11.3(Pin_3) J12.1(Pin_1) J12.2(Pin_2) J12.3(Pin_3) J12.4(Pin_4) U9.3(VSS) U10.3(VSS) U11.3(VSS) U12.3(VSS)
I2C2_SCL: J9.1(Pin_1) U11.1 U11.10(NC) ; port I2C2_SCL
I2C2_SDA: J7.1(Pin_1) U9.1 U9.10(NC) ; port I2C2_SDA
I2C3_SCL: J9.2(Pin_2) U11.2 U11.9(NC) ; port I2C3_SCL
I2C3_SDA: J7.2(Pin_2) U9.2 U9.9(NC) ; port I2C3_SDA
I2C4_SCL: J9.3(Pin_3) U11.4 U11.7(NC) ; port I2C4_SCL
I2C4_SDA: J7.3(Pin_3) U9.4 U9.7(NC) ; port I2C4_SDA
I2C5_SCL: J9.4(Pin_4) U11.5 U11.6(NC) ; port I2C5_SCL
I2C5_SDA: J7.4(Pin_4) U9.5 U9.6(NC) ; port I2C5_SDA
SOC_UART0_RX: J8.1(Pin_1) U10.1 U10.10(NC) ; port SOC_UART0_RX
SOC_UART0_TX: J10.1(Pin_1) U12.1 U12.10(NC) ; port SOC_UART0_TX
SOC_UART1_RX: J8.2(Pin_2) U10.2 U10.9(NC) ; port SOC_UART1_RX
SOC_UART1_TX: J10.2(Pin_2) U12.2 U12.9(NC) ; port SOC_UART1_TX
SOC_UART2_RX: J8.3(Pin_3) U10.4 U10.7(NC) ; port SOC_UART2_RX
SOC_UART2_TX: J10.3(Pin_3) U12.4 U12.7(NC) ; port SOC_UART2_TX
NetU10_5: U10.5 U10.6(NC)
NetU12_5: U12.5 U12.6(NC)

Not connected (* = marked no-connect by the designer): U9 8(VSS); U10 8(VSS); U11 8(VSS); U12 8(VSS)

### Notes on the sheet
- I2C have internal 2.2k resistor pull-up to 3V3 on som board
- 1
- 2
- 3
- 4
- 5
- 6
- 7
- 8
- 9
- 10
- 11
- A
- B
- C
- D
- E
- F
- G
- H
- Title: Primer Carrier for LattePanda Mu
- File: GPIO.kicad_sch
- Sheet: /
- DFRobot
- KiCad E.D.A.  kicad (5.1.4)-1
- Size: A2
- Date: 2024-03-13
- Rev: V1.0.0
- Id: 1/1

### Library data of the parts
U9-U12 = D3V3XA4B10LP: Value: ULC0524P; Footprint: A_HDJ_Library:Diodes_UDFN-10_1.0x2.5mm_P0.5mm
J7 J9 J12 J13 = Conn_01x04_Pin: Value: Conn_01x04_Pin; Footprint: A_HDJ_Library:PinHeader_1x04_P2.54mm_Vertical
J8 J10 J11 J14 = Conn_01x03_Pin: Value: Conn_01x03_Pin; Footprint: A_HDJ_Library:PinHeader_1x03_P2.54mm_Vertical